# Altium project RFSOC_SAWG.PrjPCB (part 3 of 10)

## Sheet B2B_1.SchDoc: RFSOC_SAWG
size 420 x 297 mm; Author: G.Kasprowicz; CompanyName: WUT ISE; DrawnBy: G.Kasprowicz; Organization: WUT ISE; Address1: PW ISE; Address2: Nowowiejska 15/19 00-665 Warsaw; Address3: gkasprow@gmail.com; DocumentNumber: 10; Revision: 1; SheetNumber: 10; SheetTotal: 20; ModifiedBy: -; CheckedDate: -; Title2: B2B 1; DivGrp: WUT ISE; Designer: G.Kasprowicz; ModifiedDate: -; ProjectName: Sensor Box
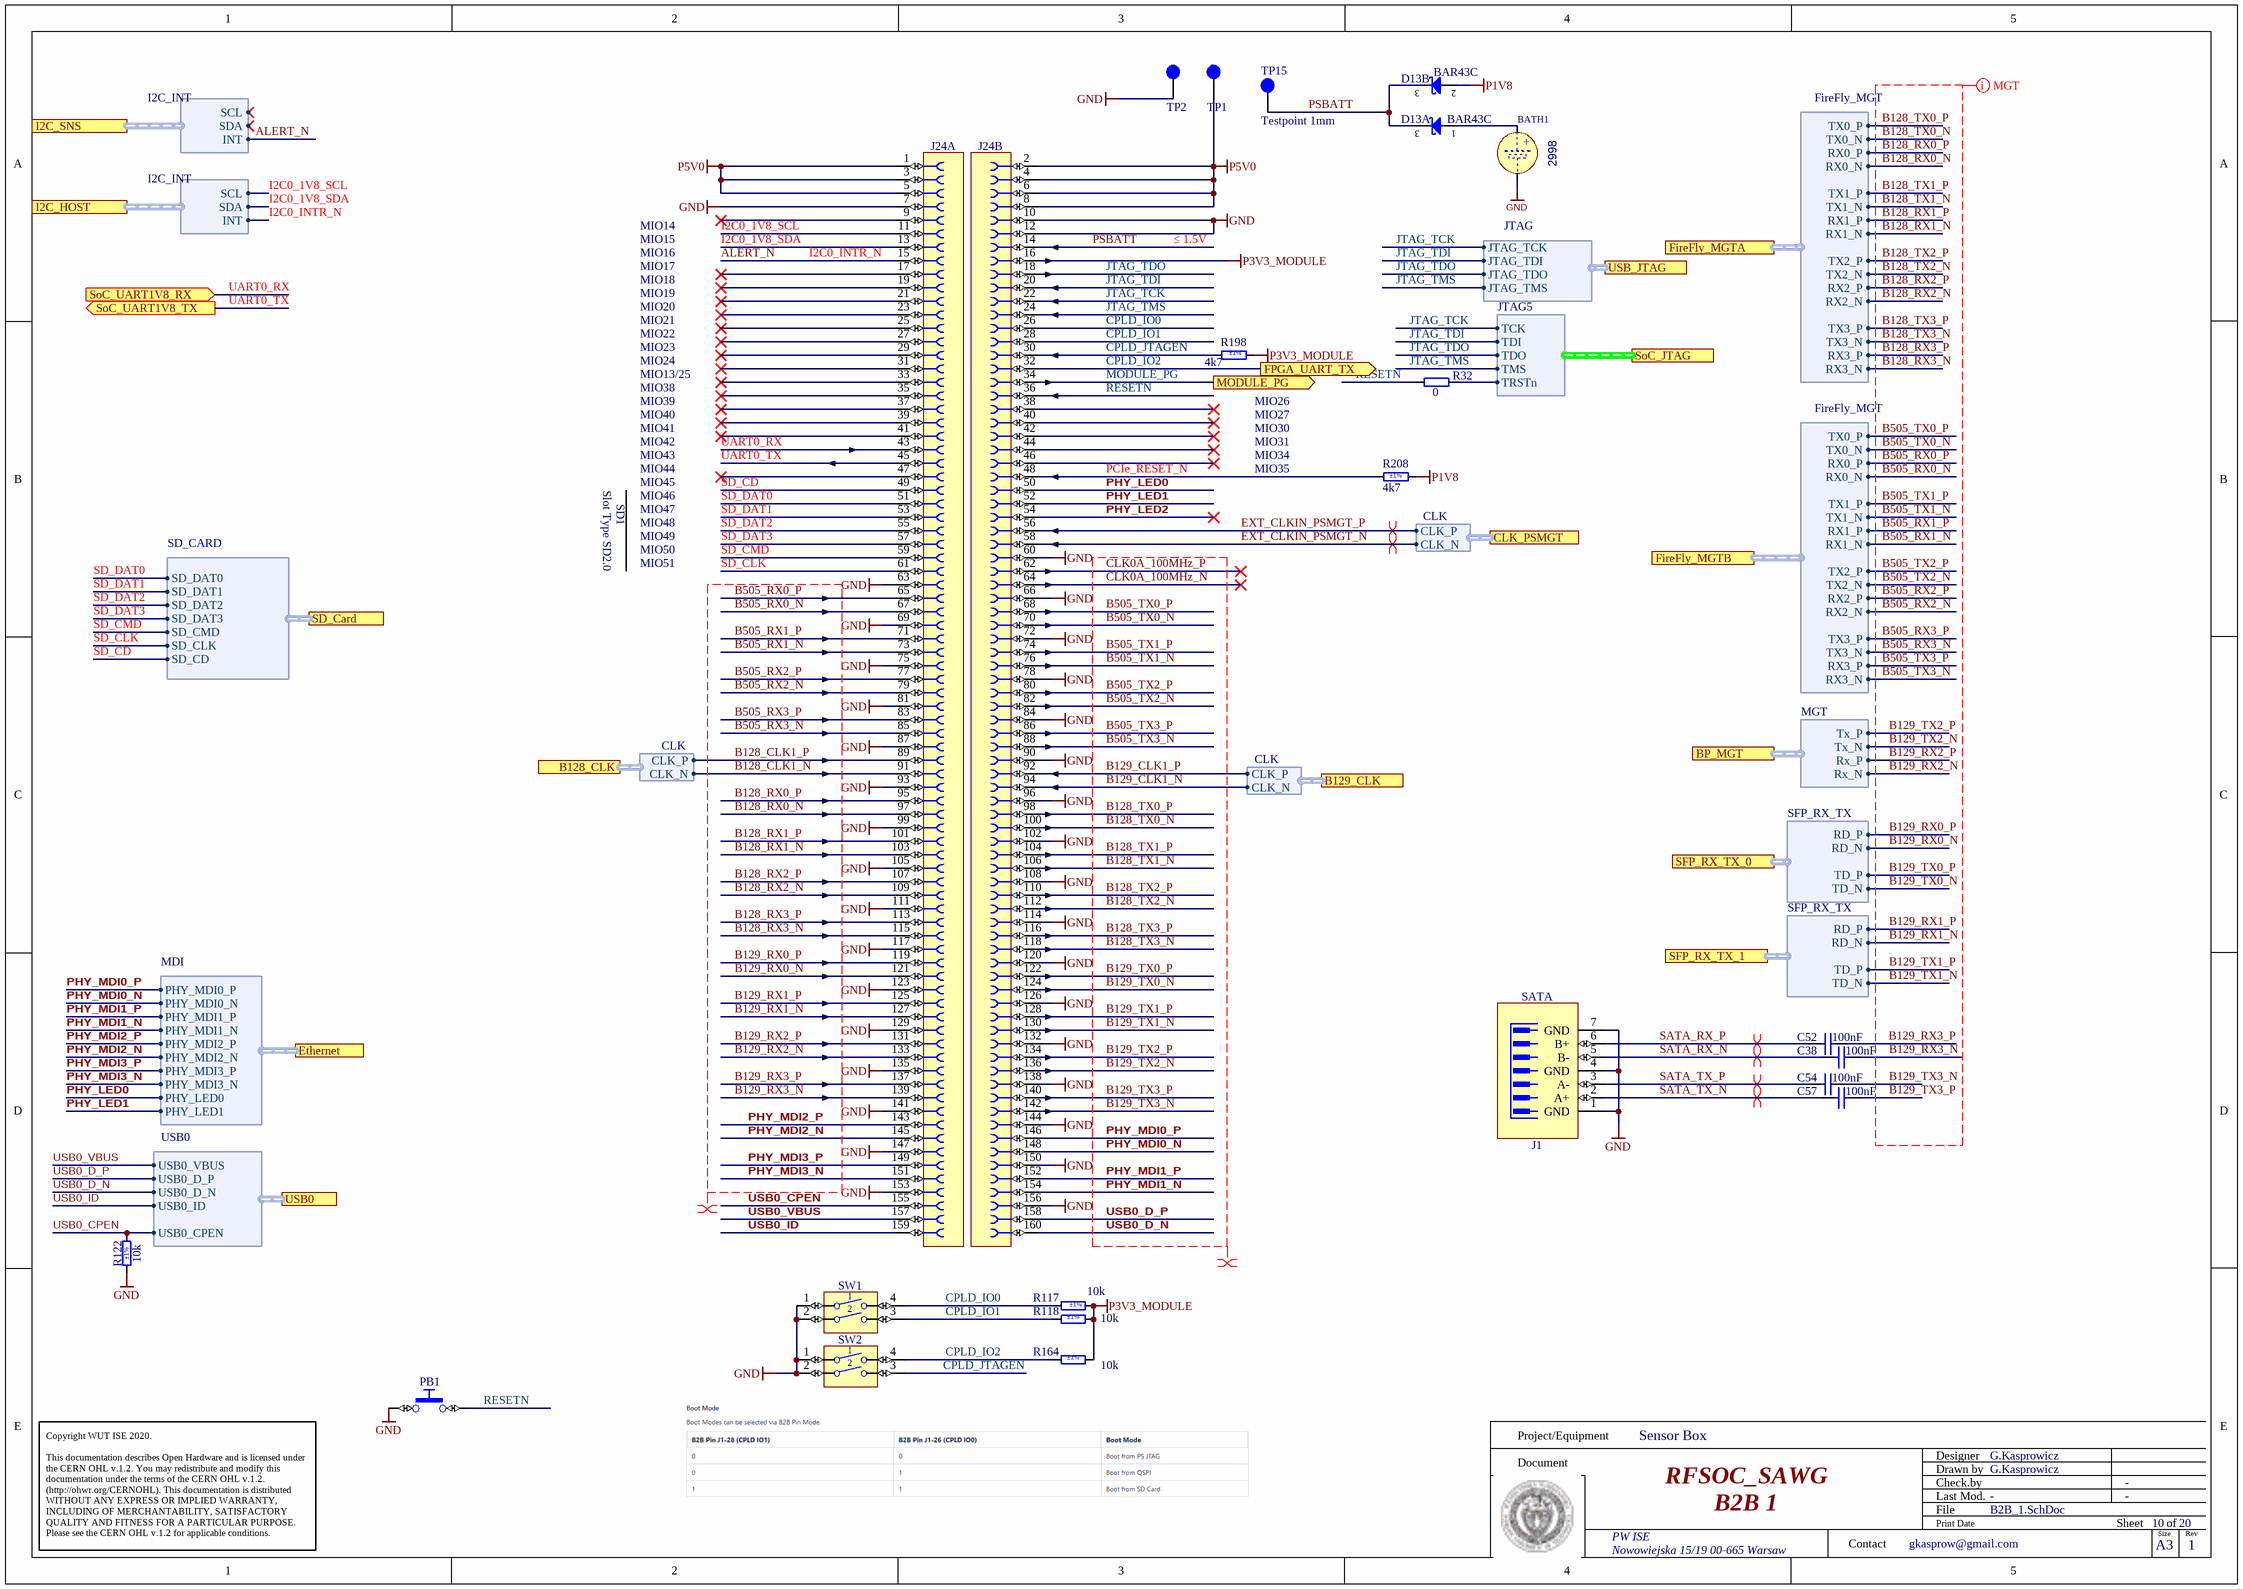
[diagram p5: B2B_1.SchDoc]

### Parts
BATH1  Manufacturer Part Number: 2998  [BATH_KEYSTONE_2998]
C38  100nF  [CAPC0603X33N]
C52  100nF  [CAPC0603X33N]
C54  100nF  [CAPC0603X33N]
C57  100nF  [CAPC0603X33N]
D13  BAR43C  [SOT95P240X130-3N]  (parts A,B of 2)
J1  SATA  [MOLEX_67800-5005]
J24  Socket 160  [SAMTEC_SS5-80-3.00-L-D-K]  (value not drawn)  (parts A,B of 2)
PB1  Push Button  [PB_TYCO_FSMSM]  (value not drawn)
R32  0  [RESC1005X40N]
R117  10k  Tolerance: ±1%  [RESC1005X40N]
R118  10k  Tolerance: ±1%  [RESC1005X40N]
R122  10k  Tolerance: ±1%  [RESC1005X40N]
R164  10k  Tolerance: ±1%  [RESC1005X40N]
R198  4k7  Tolerance: ±1%  [RESC1005X40N]
R208  4k7  Tolerance: ±1%  [RESC1005X40N]
SW1  Switch  [SW_OMRON_A6H-2102]  (value not drawn)
SW2  Switch  [SW_OMRON_A6H-2102]  (value not drawn)
TP1  Testpoint 0.8mm  [TP_0.8mm]  (value not drawn)  (no BOM)
TP2  Testpoint 0.8mm  [TP_0.8mm]  (value not drawn)  (no BOM)
TP15  Testpoint 1mm  [TP_1mm]  (no BOM)

### Ports
B128_CLK (harness CLK), B129_CLK (harness CLK), BP_MGT (harness MGT), CLK_PSMGT (harness CLK), Ethernet (harness MDI), FireFly_MGTA (harness FireFly_MGT), FireFly_MGTB (harness FireFly_MGT), FPGA_UART_TX (out), I2C_HOST (harness I2C_INT), I2C_SNS (harness I2C_INT), MODULE_PG (out), SD_Card (harness SD_CARD), SFP_RX_TX_0 (harness SFP_RX_TX), SFP_RX_TX_1 (harness SFP_RX_TX), SoC_JTAG (harness JTAG5), SoC_UART1V8_RX (in), SoC_UART1V8_TX (out), USB0 (harness USB0), USB_JTAG (harness JTAG)

### Harnesses
FireFly_MGT: RX1_P, RX1_N, RX2_P, RX2_N, RX3_P, RX3_N, RX0_P, RX0_N, TX1_P, TX1_N, TX2_P, TX2_N, TX3_P, TX3_N, TX0_P, TX0_N
SD_CARD: SD_DAT0, SD_DAT1, SD_DAT2, SD_DAT3, SD_CMD, SD_CLK, SD_CD
I2C_INT: SDA, SCL, INT
USB0: USB0_VBUS, USB0_D_P, USB0_D_N, USB0_ID, USB0_CPEN
MDI: PHY_MDI0_N, PHY_MDI1_P, PHY_MDI1_N, PHY_MDI2_P, PHY_MDI2_N, PHY_MDI3_P, PHY_MDI3_N, PHY_LED0, PHY_LED1, PHY_MDI0_P
CLK: CLK_P, CLK_N
JTAG5: TCK, TDI, TDO, TMS, TRSTn
MGT: Tx_P, Tx_N, Rx_P, Rx_N
SFP_RX_TX: RD_P, RD_N, TD_P, TD_N
JTAG: JTAG_TCK, JTAG_TDI, JTAG_TDO, JTAG_TMS

### Nets
GND: BATH1.2(MINUS) J1.1(GND) J1.4(GND) J1.7(GND) J24.7 J24.10 J24.12 J24.60 J24.63 J24.66 J24.69 J24.72 J24.75 J24.78 J24.81 J24.84 J24.87 J24.90 J24.93 J24.96 J24.99 J24.102 J24.105 J24.108 J24.111 J24.114 J24.117 J24.120 J24.123 J24.126 J24.129 J24.132 J24.135 J24.138 J24.141 J24.144 J24.147 J24.150 J24.153 J24.156 PB1.1 R122.1 SW1.1 SW1.2 SW2.1 SW2.2 TP2.1
P1V8: D13.2(A) R208.1
P3V3_MODULE: J24.16 R117.2 R118.2 R164.2 R198.1
P5V0: J24.1 J24.2 J24.3 J24.4 J24.5 J24.6 J24.8 TP1.1
ALERT_N: J24.15 ; port I2C_HOST.INT, port I2C_SNS.INT  [also labelled I2C0_INTR_N]
B128_CLK1_N: J24.91 ; port B128_CLK.CLK_N
B128_CLK1_P: J24.89 ; port B128_CLK.CLK_P
B128_RX0_N: J24.97 ; port FireFly_MGTA.RX0_N
B128_RX0_P: J24.95 ; port FireFly_MGTA.RX0_P
B128_RX1_N: J24.103 ; port FireFly_MGTA.RX1_N
B128_RX1_P: J24.101 ; port FireFly_MGTA.RX1_P
B128_RX2_N: J24.109 ; port FireFly_MGTA.RX2_N
B128_RX2_P: J24.107 ; port FireFly_MGTA.RX2_P
B128_RX3_N: J24.115 ; port FireFly_MGTA.RX3_N
B128_RX3_P: J24.113 ; port FireFly_MGTA.RX3_P
B128_TX0_N: J24.100 ; port FireFly_MGTA.TX0_N
B128_TX0_P: J24.98 ; port FireFly_MGTA.TX0_P
B128_TX1_N: J24.106 ; port FireFly_MGTA.TX1_N
B128_TX1_P: J24.104 ; port FireFly_MGTA.TX1_P
B128_TX2_N: J24.112 ; port FireFly_MGTA.TX2_N
B128_TX2_P: J24.110 ; port FireFly_MGTA.TX2_P
B128_TX3_N: J24.118 ; port FireFly_MGTA.TX3_N
B128_TX3_P: J24.116 ; port FireFly_MGTA.TX3_P
B129_CLK1_N: J24.94 ; port B129_CLK.CLK_N
B129_CLK1_P: J24.92 ; port B129_CLK.CLK_P
B129_RX0_N: J24.121 ; port SFP_RX_TX_0.RD_N
B129_RX0_P: J24.119 ; port SFP_RX_TX_0.RD_P
B129_RX1_N: J24.127 ; port SFP_RX_TX_1.RD_N
B129_RX1_P: J24.125 ; port SFP_RX_TX_1.RD_P
B129_RX2_N: J24.133 ; port BP_MGT.Rx_N
B129_RX2_P: J24.131 ; port BP_MGT.Rx_P
B129_RX3_N: C38.2 J24.139
B129_RX3_P: C52.2 J24.137
B129_TX0_N: J24.124 ; port SFP_RX_TX_0.TD_N
B129_TX0_P: J24.122 ; port SFP_RX_TX_0.TD_P
B129_TX1_N: J24.130 ; port SFP_RX_TX_1.TD_N
B129_TX1_P: J24.128 ; port SFP_RX_TX_1.TD_P
B129_TX2_N: J24.136 ; port BP_MGT.Tx_N
B129_TX2_P: J24.134 ; port BP_MGT.Tx_P
B129_TX3_N: C54.2 J24.142
B129_TX3_P: C57.2 J24.140
B505_RX0_N: J24.67 ; port FireFly_MGTB.RX0_N
B505_RX0_P: J24.65 ; port FireFly_MGTB.RX0_P
B505_RX1_N: J24.73 ; port FireFly_MGTB.RX1_N
B505_RX1_P: J24.71 ; port FireFly_MGTB.RX1_P
B505_RX2_N: J24.79 ; port FireFly_MGTB.RX2_N
B505_RX2_P: J24.77 ; port FireFly_MGTB.RX2_P
B505_RX3_N: J24.85 ; port FireFly_MGTB.TX3_N
B505_RX3_P: J24.83 ; port FireFly_MGTB.TX3_P
B505_TX0_N: J24.70 ; port FireFly_MGTB.TX0_N
B505_TX0_P: J24.68 ; port FireFly_MGTB.TX0_P
B505_TX1_N: J24.76 ; port FireFly_MGTB.TX1_N
B505_TX1_P: J24.74 ; port FireFly_MGTB.TX1_P
B505_TX2_N: J24.82 ; port FireFly_MGTB.TX2_N
B505_TX2_P: J24.80 ; port FireFly_MGTB.TX2_P
B505_TX3_N: J24.88 ; port FireFly_MGTB.RX3_N
B505_TX3_P: J24.86 ; port FireFly_MGTB.RX3_P
CLK0A_100MHz_N: J24.64
CLK0A_100MHz_P: J24.62
CPLD_IO0: J24.26 R117.1 SW1.4
CPLD_IO1: J24.28 R118.1 SW1.3
CPLD_IO2: J24.32 R164.1 SW2.4 ; port FPGA_UART_TX
CPLD_JTAGEN: J24.30 R198.2 SW2.3
EXT_CLKIN_PSMGT_N: J24.58 ; port CLK_PSMGT.CLK_N  [project net CK_GTP_N]
EXT_CLKIN_PSMGT_P: J24.56 ; port CLK_PSMGT.CLK_P  [project net CK_GTP_P]
I2C0_1V8_SCL: J24.11 ; port I2C_HOST.SCL
I2C0_1V8_SDA: J24.13 ; port I2C_HOST.SDA
JTAG_TCK: J24.22 ; port SoC_JTAG.TCK, port USB_JTAG.JTAG_TCK
JTAG_TDI: J24.20 ; port SoC_JTAG.TDI, port USB_JTAG.JTAG_TDI
JTAG_TDO: J24.18 ; port SoC_JTAG.TDO, port USB_JTAG.JTAG_TDO
JTAG_TMS: J24.24 ; port SoC_JTAG.TMS, port USB_JTAG.JTAG_TMS
JTAG_TRSTn: R32.2 ; port SoC_JTAG.TRSTn
MODULE_PG: J24.34 ; port MODULE_PG  [project net EN_clk_3V6]
PCIe_RESET_N: J24.48 R208.2
PHY_LED0: J24.50 ; port Ethernet.PHY_LED0
PHY_LED1: J24.52 ; port Ethernet.PHY_LED1
PHY_LED2: J24.54
PHY_MDI0_N: J24.148 ; port Ethernet.PHY_MDI0_N
PHY_MDI0_P: J24.146 ; port Ethernet.PHY_MDI0_P
PHY_MDI1_N: J24.154 ; port Ethernet.PHY_MDI1_N
PHY_MDI1_P: J24.152 ; port Ethernet.PHY_MDI1_P
PHY_MDI2_N: J24.145 ; port Ethernet.PHY_MDI2_N
PHY_MDI2_P: J24.143 ; port Ethernet.PHY_MDI2_P
PHY_MDI3_N: J24.151 ; port Ethernet.PHY_MDI3_N
PHY_MDI3_P: J24.149 ; port Ethernet.PHY_MDI3_P
PSBATT: D13.3(COMC) J24.14 TP15.1
RESETN: J24.36 PB1.2 R32.1
SATA_RX_N: C38.1 J1.5(B-)
SATA_RX_P: C52.1 J1.6(B+)
SATA_TX_N: C57.1 J1.2(A+)
SATA_TX_P: C54.1 J1.3(A-)
SD_CD: J24.49 ; port SD_Card.SD_CD
SD_CLK: J24.61 ; port SD_Card.SD_CLK
SD_CMD: J24.59 ; port SD_Card.SD_CMD
SD_DAT0: J24.51 ; port SD_Card.SD_DAT0
SD_DAT1: J24.53 ; port SD_Card.SD_DAT1
SD_DAT2: J24.55 ; port SD_Card.SD_DAT2
SD_DAT3: J24.57 ; port SD_Card.SD_DAT3
UART0_RX: J24.43 ; port SoC_UART1V8_RX
UART0_TX: J24.45 ; port SoC_UART1V8_TX
USB0_CPEN: J24.155 R122.2 ; port USB0.USB0_CPEN
USB0_D_N: J24.160 ; port USB0.USB0_D_N
USB0_D_P: J24.158 ; port USB0.USB0_D_P
USB0_ID: J24.159 ; port USB0.USB0_ID
USB0_VBUS: J24.157 ; port USB0.USB0_VBUS
NetBATH1_1: BATH1.1(PLUS) D13.1(A)

Not connected (* = marked no-connect by the designer): J24 9* 17* 19* 21* 23* 25* 27* 29* 31* 33* 35* 37* 38* 39* 40* 41* 42* 44* 46* 47*

### Layout directives
differential pair: B128_CLK1_N, B128_CLK1_P, B128_RX0_N, B128_RX0_P, B128_RX1_N, B128_RX1_P, B128_RX2_N, B128_RX2_P, B128_RX3_N, B128_RX3_P, B128_TX0_N, B128_TX0_P, B128_TX1_N, B128_TX1_P, B128_TX2_N, B128_TX2_P, B128_TX3_N, B128_TX3_P, B129_CLK1_N, B129_CLK1_P, B129_RX0_N, B129_RX0_P, B129_RX1_N, B129_RX1_P, B129_RX2_N, B129_RX2_P, B129_RX3_N, B129_RX3_P, B129_TX0_N, B129_TX0_P, B129_TX1_N, B129_TX1_P, B129_TX2_N, B129_TX2_P, B129_TX3_N, B129_TX3_P, B505_RX0_N, B505_RX0_P, B505_RX1_N, B505_RX1_P, B505_RX2_N, B505_RX2_P, B505_RX3_N, B505_RX3_P, B505_TX0_N, B505_TX0_P, B505_TX1_N, B505_TX1_P, B505_TX2_N, B505_TX2_P, B505_TX3_N, B505_TX3_P, CK_GTP_N, CK_GTP_P, CLK0A_100MHz_N, CLK0A_100MHz_P, PHY_MDI0_N, PHY_MDI0_P, PHY_MDI1_N, PHY_MDI1_P, PHY_MDI2_N, PHY_MDI2_P, PHY_MDI3_N, PHY_MDI3_P, USB0_D_N, USB0_D_P
differential pair; net class Diff_100Ohm: SATA_RX_N, SATA_RX_P, SATA_TX_N, SATA_TX_P
net class MGT: B128_RX0_N, B128_RX0_P, B128_RX1_N, B128_RX1_P, B128_RX2_N, B128_RX2_P, B128_RX3_N, B128_RX3_P, B128_TX0_N, B128_TX0_P, B128_TX1_N, B128_TX1_P, B128_TX2_N, B128_TX2_P, B128_TX3_N, B128_TX3_P, B129_RX0_N, B129_RX0_P, B129_RX1_N, B129_RX1_P, B129_RX2_N, B129_RX2_P, B129_RX3_N, B129_RX3_P, B129_TX0_N, B129_TX0_P, B129_TX1_N, B129_TX1_P, B129_TX2_N, B129_TX2_P, B129_TX3_N, B129_TX3_P, B505_RX0_N, B505_RX0_P, B505_RX1_N, B505_RX1_P, B505_RX2_N, B505_RX2_P, B505_RX3_N, B505_RX3_P, B505_TX0_N, B505_TX0_P, B505_TX1_N, B505_TX1_P, B505_TX2_N, B505_TX2_P, B505_TX3_N, B505_TX3_P

### Notes on the sheet
- MIO14
- MIO15
- MIO16
- ≤ 1.5V
- MIO17
- MIO18
- MIO19
- MIO20
- MIO21
- MIO22
- MIO23
- MIO24
- MIO13/25
- MIO38
- MIO39
- MIO40
- MIO41
- MIO42
- MIO43
- (near R198) MIO26
- MIO27
- MIO30
- MIO31
- MIO34
- Slot Type SD2.0
- SD1
- MIO45
- MIO46
- MIO47
- MIO48
- MIO44
- MIO35
- MIO49
- MIO50
- MIO51
- Project/Equipment
- Document
- Designer
- Drawn by
- Check.by
- Copyright WUT ISE 2020.
  This documentation describes Open Hardware and is licensed under the CERN OHL v.1.2. You may redistribute and modify this documentation under the terms of the CERN OHL v.1.2. (http://ohwr.org/CERNOHL). This documentation is distributed WITHOUT ANY EXPRESS OR IMPLIED WARRANTY, INCLUDING OF MERCHANTABILITY, SATISFACTORY QUALITY AND FITNESS FOR A PARTICULAR PURPOSE. Please see the CERN OHL v.1.2 for applicable conditions.
- Contact
- File
- Last Mod.
- Print Date
- Sheet
- Size
- A3
- of
- Rev
- (in symbol BATH_KEYSTONE_2998) +

### Library data of the parts
BATH1 = BATH_KEYSTONE_2998: Battery Holder whit 2 Pin; Part Description: SMD Battery Holder for MC621, V364, SC621, DR13H, DR77, V13AT, 377 Button Cells; PressFit: No; Manufacturer: KEYSTONE; PackageDescription: SMD Battery Holder for MC621, V364, SC621, DR13H, DR77, V13AT, 377 Button Cells; Part Number: BATH_KEYSTONE_2998; Component Kind: Standard; Component Type: Standard; Pin Count: 3; Family: Battery; Mounted: Yes; Socket: No; SMD: Yes; Sense: No; ComponentHeight: 3.048mm; HelpURL: \\cern.ch\dfs\Applications\Altium\Datasheets\BATH_KEYSTONE_2998.pdf; Author: CERN DEM JLC; CreateDate: 03.07.2014; LatestRevisionDate: 07.06.2017
C38 C52 C54 C57 = CC0201_100NF_6.3V_10%_X5R: Non-polarised capacitor; Part Description: SMD Multilayer Chip Ceramic Capacitor; Manufacturer: GENERIC; Manufacturer1 Part Number: 02016D104KAT2A; Voltage: 6.3V; TC: X5R; Tolerance: ±10%; Part Number: CC0201_100NF_6.3V_10%_X5R; Component Kind: Standard; Component Type: Standard; Pin Count: 2; Value: 100nF; Status: Not Recommended; Manufacturer Part Number: CC0201_100NF_6.3V_10%_X5R; Case: 0201; Mounted: Yes; Socket: No; SMD: Yes; Sense: No; Manufacturer1 Example: AVX; Manufacturer1 ComponentHeight: 0.33mm; HelpURL: \\cern.ch\dfs\Applications\Altium\Datasheets\CC0201_X5R_AVX.pdf; Author: CERN DEM JLC; CreateDate: 2007-12-03; LatestRevisionDate: 2007-12-03; ClassName: SATA
D13 = BAR43C: Dual Common Cathode Schottky Diodes; Manufacturer: FAIRCHILD SEMICONDUCTOR; Voltage: 30V; Power: 200mA; PressFit: No; Bonding: No; Part Number: BAR43C; Component Kind: Standard; Component Type: Standard; Device: BAR43C; PackageDescription: SOT, 0.95mm Pitch; 3 Pin, 1.30mm W X 2.90mm L X 1.30mm H body, IPC Medium Density; Part Description: Dual Common Cathode Schottky Diode; Manufacturer Part Number: BAR43C; Pin Count: 3; Case: SOT23-3; Mounted: Yes; Socket: No; SMD: Yes; Sense: No; ComponentHeight: 1.30mm; HelpURL: \\cern.ch\dfs\Applications\Altium\Datasheets\BAR43C.pdf; Author: CERN DEM JLC; CreateDate: 27.05.2010; LatestRevisionDate: 27.05.2010
J1 = MOLEX_67800-5005: 7 Pin SATA Receptacle; Part Description: 1.27mm Pitch, 7 Contacts, Serial ATA High Speed Header, Straight with Locking Latch; Manufacturer: MOLEX; PressFit: No; Part Number: MOLEX_67800-5005; Component Kind: Standard; Component Type: Standard; Pin Count: 7; Family: SATA; Mounted: Yes; Socket: No; SMD: Yes; Sense: No; Status: None; Manufacturer Part Number: 67800-5005; ComponentHeight: 8.4mm; HelpURL: \\cern.ch\dfs\Applications\Altium\Datasheets\MOLEX_67800-5005.pdf; Author: CERN DEM MR; CreateDate: 01.12.2016; LatestRevisionDate: 01.12.2016; ClassName: SATA
J24 = SAMTEC_SS5-80-3.00-L-D-K: Connector 160 Female; Part Description: 160 Contacts, Pitch 0.50 mm Micro Blade & Beam Low-Profile Socket; Manufacturer: SAMTEC; PressFit: No; Part Number: SAMTEC_SS5-80-3.00-L-D-K; Component Kind: Standard; Component Type: Standard; Pin Count: 160; Family: Socket 160; Mounted: Yes; Socket: No; SMD: Yes; Sense: No; Status: None; Manufacturer Part Number: SS5-80-3.00-L-D-K; ComponentHeight: 4mm; HelpURL: \\cern.ch\dfs\Applications\Altium\Datasheets\SAMTEC_SS5-80-3.00-L-D-K.pdf; Author: CERN DEM BC; CreateDate: 11.08.2021; LatestRevisionDate: 11.08.2021
PB1 = PB_TYCO_FSMSM: Push-Button Switch SPDT; Part Description: 12VDC 50mA SPST Tactile  Push-Button Switch; Manufacturer: TYCO ELECTRONICS; Manufacturer Part Number: FSMSM or 1437566-3; PressFit: No; Part Number: PB_TYCO_FSMSM; Component Kind: Standard; Component Type: Standard; Pin Count: 2; PackageDescription: Body 3.5x6.0mm, Pushbutton Switch,  TYCO ALCOSWITCH FSMSM Serie; Family: Push Button; Mounted: Yes; Socket: No; SMD: Yes; Sense: No; Status: None; ComponentHeight: 4.3mm; HelpURL: \\cern.ch\dfs\Applications\Altium\Datasheets\PB_TYCO_FSMSM.pdf; Author: CERN DEM JLC; CreateDate: 30.06.2008; LatestRevisionDate: 21.06.2012
R32 = R0402_0R_JUMPER: Resistor; Part Description: 1A (0.05R Max DC Resistance) Zero Ohm Jumper; Manufacturer: GENERIC; Manufacturer1 Part Number: 232270591001L; PressFit: No; Part Number: R0402_0R_JUMPER; Component Kind: Standard; Component Type: Standard; Pin Count: 2; Value: 0; Status: Not Recommended; Manufacturer Part Number: R0402_0R_JUMPER; Case: 0402; Mounted: Yes; Sense: No; Socket: No; SMD: Yes; Manufacturer1 Example: YAGEO PHYCOMP; Manufacturer1 ComponentHeight: 0.4mm; HelpURL: \\cern.ch\dfs\Applications\Altium\Datasheets\R0402_Phycomp_RC0402.pdf; Author: CERN DEM JLC; CreateDate: 03.12.2007; LatestRevisionDate: 17.10.2012
R117 R118 R122 R164 = R0402_10K_1%_0.0625W_100PPM: Resistor - 1%; Part Description: General Purpose Thick Film Chip Resistor; Manufacturer: GENERIC; Manufacturer1 Part Number: 232270671003L; TC: ±100ppm/°C; PressFit: No; Case: 0402; Value: 10k; Part Number: R0402_10K_1%_0.0625W_100PPM; Component Kind: Standard; Component Type: Standard; Pin Count: 2; Status: Not Recommended; Power: 0.0625W; Manufacturer Part Number: R0402_10K_1%_0.0625W_100PPM; Mounted: Yes; Sense: No; Socket: No; SMD: Yes; Manufacturer1 Example: YAGEO PHYCOMP; Manufacturer1 ComponentHeight: 0.4mm; HelpURL: \\cern.ch\dfs\Applications\Altium\Datasheets\R0402_Phycomp_RC0402.pdf; Author: CERN DEM JLC; CreateDate: 03.12.2007; LatestRevisionDate: 17.10.2012
R198 R208 = R0402_4K7_1%_0.0625W_100PPM: Resistor - 1%; Part Description: General Purpose Thick Film Chip Resistor; Manufacturer: GENERIC; Manufacturer1 Part Number: 232270674702L; TC: ±100ppm/°C; PressFit: No; Case: 0402; Value: 4k7; Part Number: R0402_4K7_1%_0.0625W_100PPM; Component Kind: Standard; Component Type: Standard; Pin Count: 2; Status: Not Recommended; Power: 0.0625W; Manufacturer Part Number: R0402_4K7_1%_0.0625W_100PPM; Mounted: Yes; Sense: No; Socket: No; SMD: Yes; Manufacturer1 Example: YAGEO PHYCOMP; Manufacturer1 ComponentHeight: 0.4mm; HelpURL: \\cern.ch\dfs\Applications\Altium\Datasheets\R0402_Phycomp_RC0402.pdf; Author: CERN DEM JLC; CreateDate: 03.12.2007; LatestRevisionDate: 17.10.2012
SW1 SW2 = SW_OMRON_A6H-2102: 2 Ways SPST DIP Switch; Part Description: 2 Ways Ultra-low Profile, Half-pitch, SPST DIP Switch With Seal Tape, Rating 25mA 24VDC; Manufacturer: OMRON; PressFit: No; Part Number: SW_OMRON_A6H-2102; Component Kind: Standard; Component Type: Standard; Pin Count: 4; PackageDescription: Pitch 1.27mm, Body 3.77 x 4.5mm, 2 Ways SPST Surface-Mounting DIP Switch, OMRON A6H; Family: Switch; Mounted: Yes; Socket: No; SMD: Yes; Sense: No; Status: None; Manufacturer Part Number: A6H-2102; ComponentHeight: 1.45mm; HelpURL: \\cern.ch\dfs\Applications\Altium\Datasheets\SW_OMRON_A6H-2102.pdf; Author: CERN DEM BC; CreateDate: 18.08.2021; LatestRevisionDate: 18.08.2021
TP1 TP2 = 26289: AN: 26289; Mixed: MECH
TP15 = 25063: AN: 25063; Mixed: SMT

## Sheet B2B_2.SchDoc: RFSOC_SAWG
size 420 x 297 mm; Author: G.Kasprowicz; CompanyName: WUT ISE; DrawnBy: G.Kasprowicz; Organization: WUT ISE; Address1: PW ISE; Address2: Nowowiejska 15/19 00-665 Warsaw; Address3: gkasprow@gmail.com; DocumentNumber: 11; Revision: 1; SheetNumber: 11; SheetTotal: 20; ModifiedBy: -; CheckedDate: -; Title2: B2B 2; DivGrp: WUT ISE; Designer: G.Kasprowicz; ModifiedDate: -; ProjectName: Sensor Box
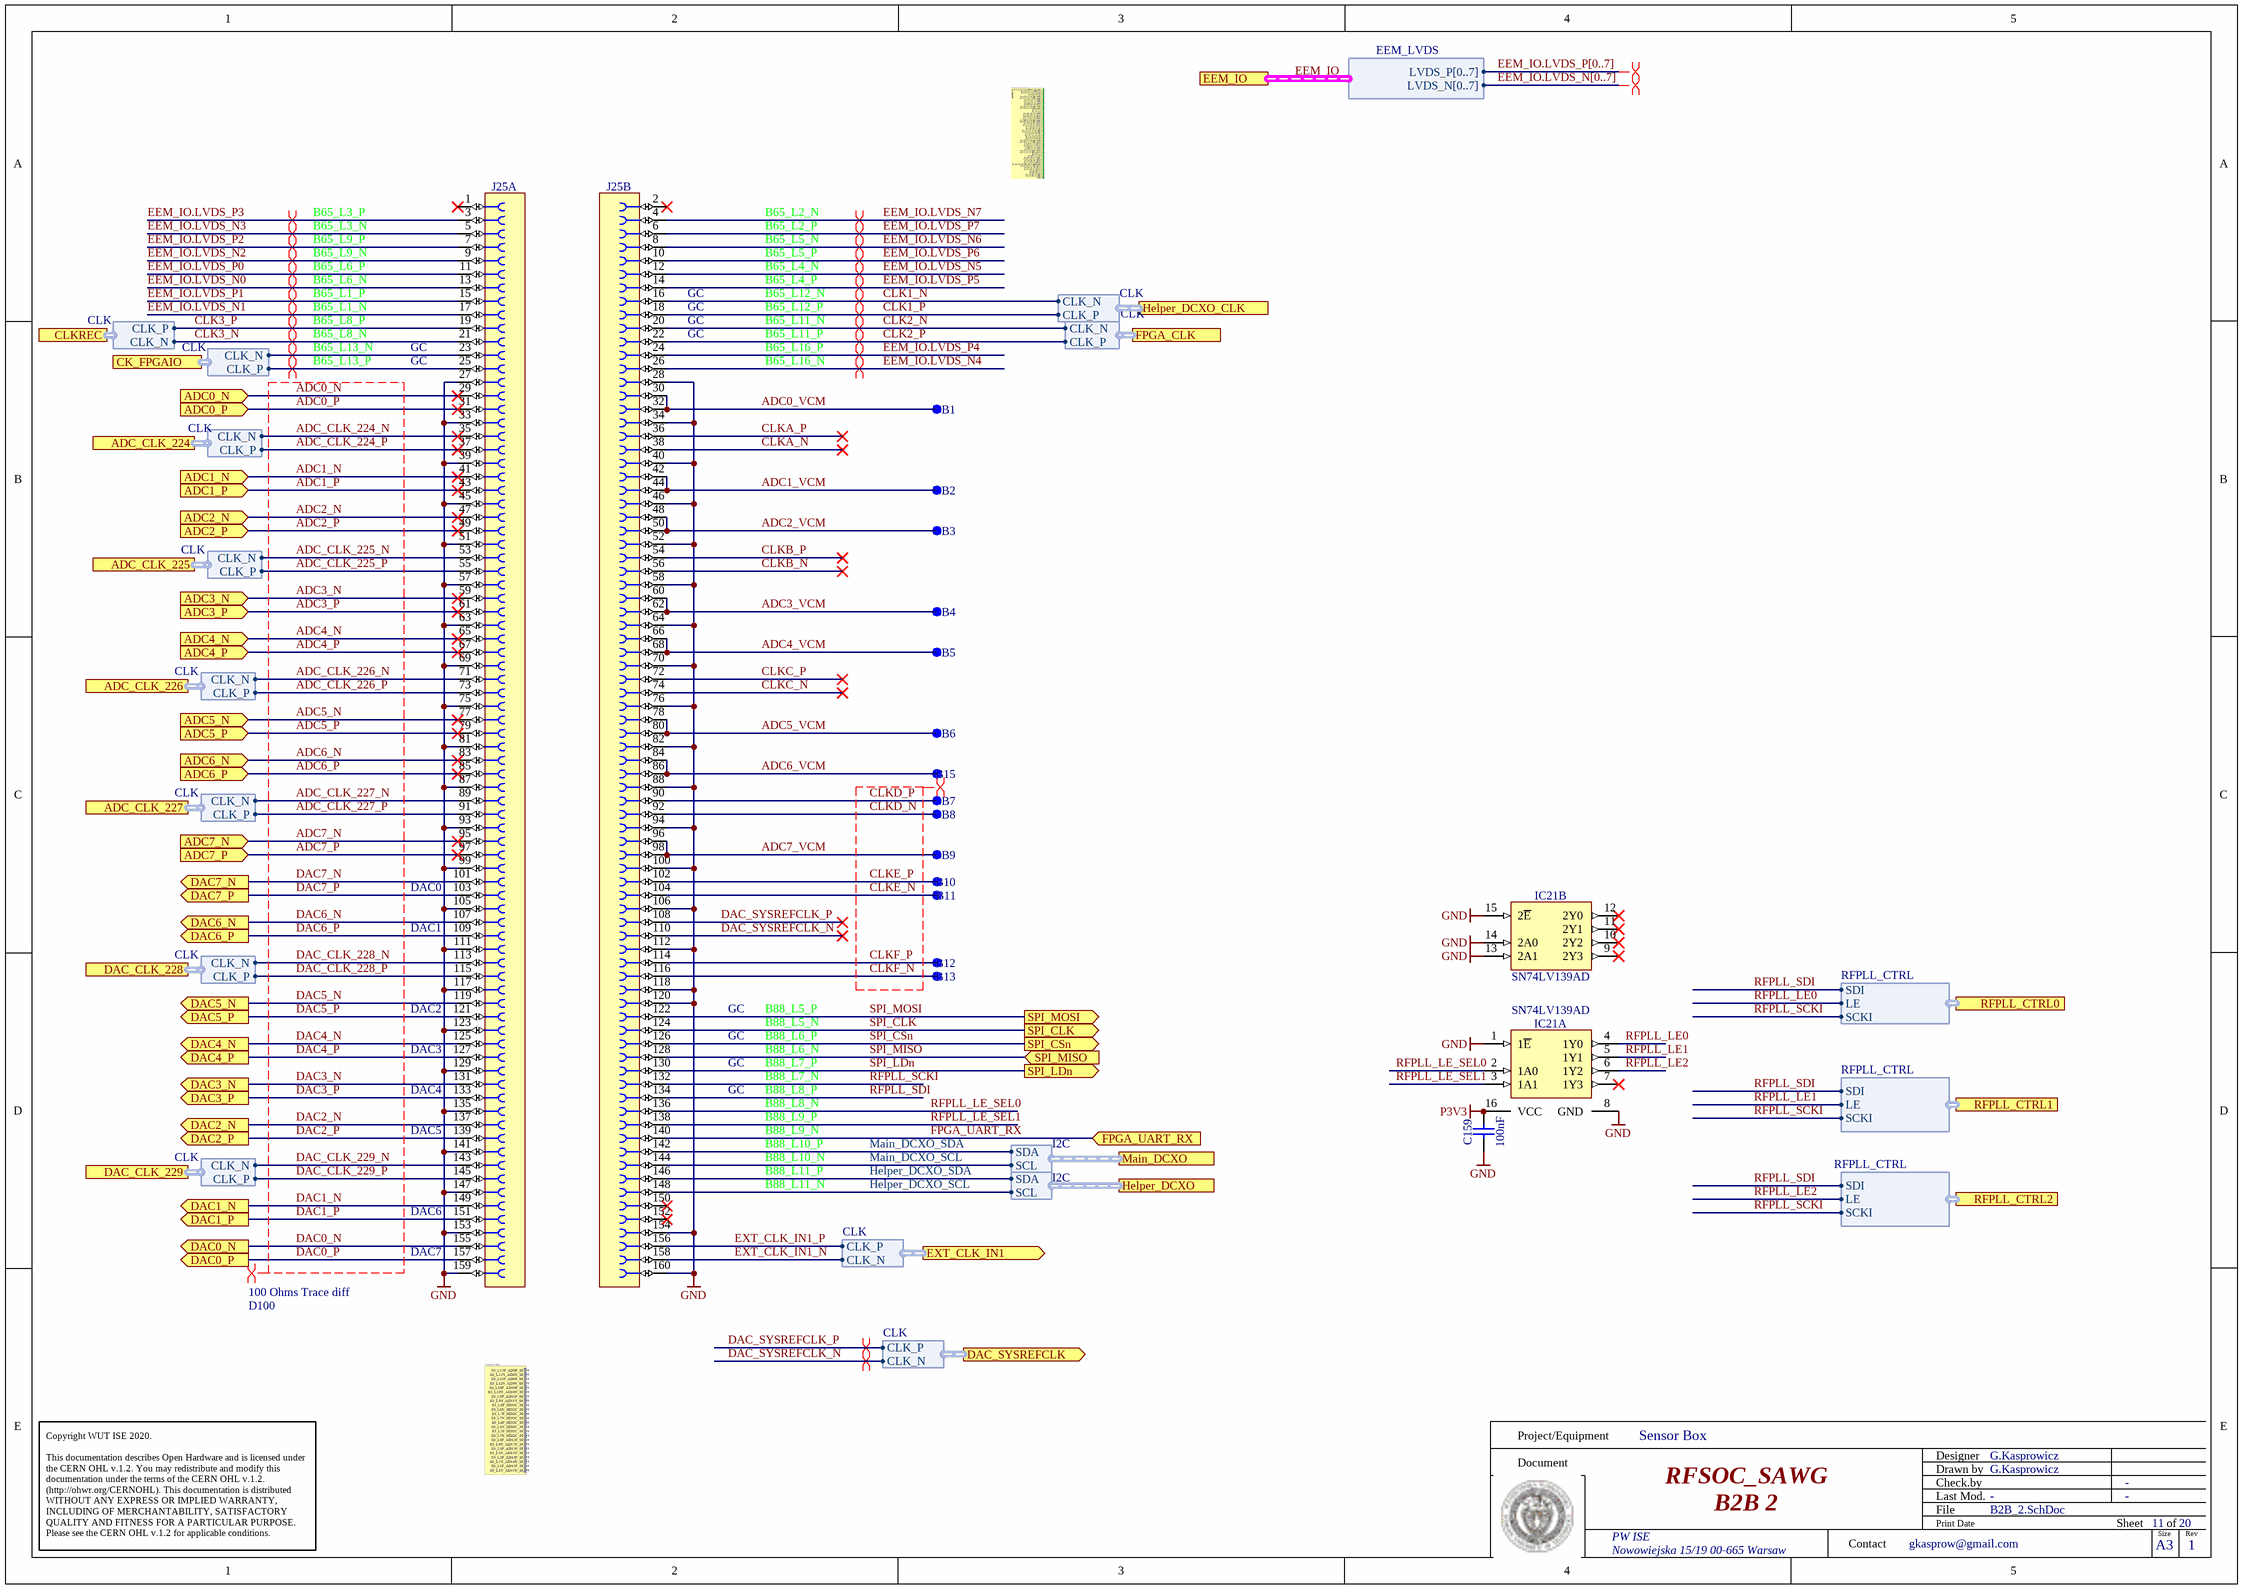
[diagram p6: B2B_2.SchDoc]

### Parts
B1  SMD Pad  [C100]  (value not drawn)  (no BOM)
B2  SMD Pad  [C100]  (value not drawn)  (no BOM)
B3  SMD Pad  [C100]  (value not drawn)  (no BOM)
B4  SMD Pad  [C100]  (value not drawn)  (no BOM)
B5  SMD Pad  [C100]  (value not drawn)  (no BOM)
B6  SMD Pad  [C100]  (value not drawn)  (no BOM)
B7  SMD Pad  [C100]  (value not drawn)  (no BOM)
B8  SMD Pad  [C100]  (value not drawn)  (no BOM)
B9  SMD Pad  [C100]  (value not drawn)  (no BOM)
B10  SMD Pad  [C100]  (value not drawn)  (no BOM)
B11  SMD Pad  [C100]  (value not drawn)  (no BOM)
B12  SMD Pad  [C100]  (value not drawn)  (no BOM)
B13  SMD Pad  [C100]  (value not drawn)  (no BOM)
B15  SMD Pad  [C100]  (value not drawn)  (no BOM)
C159  100nF  [CAPC1005X55N]
IC21  SN74LV139AD  [SOIC127P600X175-16N]  (parts A,B of 2)
J25  Socket 160  [SAMTEC_SS5-80-3.00-L-D-K]  (value not drawn)  (parts A,B of 2)

### Ports
ADC0_N (in), ADC0_P (in), ADC1_N (in), ADC1_P (in), ADC2_N (in), ADC2_P (in), ADC3_N (in), ADC3_P (in), ADC4_N (in), ADC4_P (in), ADC5_N (in), ADC5_P (in), ADC6_N (in), ADC6_P (in), ADC7_N (in), ADC7_P (in), ADC_CLK_224 (harness CLK), ADC_CLK_225 (harness CLK), ADC_CLK_226 (harness CLK), ADC_CLK_227 (harness CLK), CK_FPGAIO (harness CLK), CLKREC (harness CLK), DAC0_N (out), DAC0_P (out), DAC1_N (out), DAC1_P (out), DAC2_N (out), DAC2_P (out), DAC3_N (out), DAC3_P (out), DAC4_N (out), DAC4_P (out), DAC5_N (out), DAC5_P (out), DAC6_N (out), DAC6_P (out), DAC7_N (out), DAC7_P (out), DAC_CLK_228 (harness CLK), DAC_CLK_229 (harness CLK), DAC_SYSREFCLK (out, harness CLK), EEM_IO (harness EEM_LVDS), EXT_CLK_IN1 (out, harness CLK), FPGA_CLK (harness CLK), FPGA_UART_RX (in), Helper_DCXO (harness I2C), Helper_DCXO_CLK (harness CLK), Main_DCXO (harness I2C), RFPLL_CTRL0 (harness RFPLL_CTRL), RFPLL_CTRL1 (harness RFPLL_CTRL), RFPLL_CTRL2 (harness RFPLL_CTRL), SPI_CLK (out), SPI_CSn (out), SPI_LDn (out), SPI_MISO (in), SPI_MOSI (out)

### Harnesses
CLK: CLK_P, CLK_N
CLK: CLK_N, CLK_P
EEM_LVDS: LVDS_P[0..7], LVDS_N[0..7]
RFPLL_CTRL: SCKI, SDI, LE
I2C: SCL, SDA

### Nets
GND: C159.1 IC21.1(1~{E}) IC21.8(GND) IC21.13(2A1) IC21.14(2A0) IC21.15(2~{E}) J25.27 J25.28 J25.33 J25.34 J25.39 J25.40 J25.45 J25.46 J25.51 J25.52 J25.57 J25.58 J25.63 J25.64 J25.69 J25.70 J25.75 J25.76 J25.81 J25.82 J25.87 J25.88 J25.93 J25.94 J25.99 J25.100 J25.105 J25.106 J25.111 J25.112 J25.117 J25.118 J25.120 J25.123 J25.129 J25.135 J25.141 J25.147 J25.153 J25.154 J25.159 J25.160
P3V3: C159.2 IC21.16(VCC)
ADC0_N: J25.29 ; port ADC0_N
ADC0_P: J25.31 ; port ADC0_P
ADC0_VCM: B1.1 J25.30 J25.32
ADC1_N: J25.41 ; port ADC1_N  [project net ADC0_N]
ADC1_P: J25.43 ; port ADC1_P  [project net ADC0_P]
ADC1_VCM: B2.1 J25.42 J25.44
ADC2_N: J25.47 ; port ADC2_N  [project net ADC0_N]
ADC2_P: J25.49 ; port ADC2_P  [project net ADC0_P]
ADC2_VCM: B3.1 J25.48 J25.50
ADC3_N: J25.59 ; port ADC3_N  [project net ADC0_N]
ADC3_P: J25.61 ; port ADC3_P  [project net ADC0_P]
ADC3_VCM: B4.1 J25.60 J25.62
ADC4_N: J25.65 ; port ADC4_N  [project net ADC0_N]
ADC4_P: J25.67 ; port ADC4_P  [project net ADC0_P]
ADC4_VCM: B5.1 J25.66 J25.68
ADC5_N: J25.77 ; port ADC5_N  [project net ADC0_N]
ADC5_P: J25.79 ; port ADC5_P  [project net ADC0_P]
ADC5_VCM: B6.1 J25.78 J25.80
ADC6_N: J25.83 ; port ADC6_N  [project net ADC0_N]
ADC6_P: J25.85 ; port ADC6_P  [project net ADC0_P]
ADC6_VCM: B15.1 J25.84 J25.86
ADC7_N: J25.95 ; port ADC7_N  [project net ADC0_N]
ADC7_P: J25.97 ; port ADC7_P  [project net ADC0_P]
ADC7_VCM: B9.1 J25.96 J25.98
ADC_CLK_224_N: J25.35 ; port ADC_CLK_224.CLK_N
ADC_CLK_224_P: J25.37 ; port ADC_CLK_224.CLK_P
ADC_CLK_225_N: J25.53 ; port ADC_CLK_225.CLK_N
ADC_CLK_225_P: J25.55 ; port ADC_CLK_225.CLK_P
ADC_CLK_226_N: J25.71 ; port ADC_CLK_226.CLK_N
ADC_CLK_226_P: J25.73 ; port ADC_CLK_226.CLK_P
ADC_CLK_227_N: J25.89 ; port ADC_CLK_227.CLK_N
ADC_CLK_227_P: J25.91 ; port ADC_CLK_227.CLK_P
CK_FPGAIO_N: J25.23 ; port CK_FPGAIO.CLK_N
CK_FPGAIO_P: J25.25 ; port CK_FPGAIO.CLK_P
CLK1_N: J25.16 ; port Helper_DCXO_CLK.CLK_N
CLK1_P: J25.18 ; port Helper_DCXO_CLK.CLK_P
CLK2_N: J25.20 ; port FPGA_CLK.CLK_N
CLK2_P: J25.22 ; port FPGA_CLK.CLK_P
CLK3_N: J25.21 ; port CLKREC.CLK_N
CLK3_P: J25.19 ; port CLKREC.CLK_P
CLKA_N: J25.38
CLKA_P: J25.36
CLKB_N: J25.56
CLKB_P: J25.54
CLKC_N: J25.74
CLKC_P: J25.72
CLKD_N: B8.1 J25.92
CLKD_P: B7.1 J25.90
CLKE_N: B11.1 J25.104
CLKE_P: B10.1 J25.102
CLKF_N: B13.1 J25.116
CLKF_P: B12.1 J25.114
DAC0_N: J25.155 ; port DAC0_N
DAC0_P: J25.157 ; port DAC0_P
DAC1_N: J25.149 ; port DAC1_N  [project net DAC0_N]
DAC1_P: J25.151 ; port DAC1_P  [project net DAC0_P]
DAC2_N: J25.137 ; port DAC2_N  [project net DAC0_N]
DAC2_P: J25.139 ; port DAC2_P  [project net DAC0_P]
DAC3_N: J25.131 ; port DAC3_N  [project net DAC0_N]
DAC3_P: J25.133 ; port DAC3_P  [project net DAC0_P]
DAC4_N: J25.125 ; port DAC4_N  [project net DAC0_N]
DAC4_P: J25.127 ; port DAC4_P  [project net DAC0_P]
DAC5_N: J25.119 ; port DAC5_N  [project net DAC0_N]
DAC5_P: J25.121 ; port DAC5_P  [project net DAC0_P]
DAC6_N: J25.107 ; port DAC6_N  [project net DAC0_N]
DAC6_P: J25.109 ; port DAC6_P  [project net DAC0_P]
DAC7_N: J25.101 ; port DAC7_N  [project net DAC0_N]
DAC7_P: J25.103 ; port DAC7_P  [project net DAC0_P]
DAC_CLK_228_N: J25.113 ; port DAC_CLK_228.CLK_N
DAC_CLK_228_P: J25.115 ; port DAC_CLK_228.CLK_P
DAC_CLK_229_N: J25.143 ; port DAC_CLK_229.CLK_N
DAC_CLK_229_P: J25.145 ; port DAC_CLK_229.CLK_P
DAC_SYSREFCLK_N: J25.110 ; port DAC_SYSREFCLK.CLK_N
DAC_SYSREFCLK_P: J25.108 ; port DAC_SYSREFCLK.CLK_P
EEM_IO.LVDS_N0: J25.13
EEM_IO.LVDS_N1: J25.17
EEM_IO.LVDS_N2: J25.9
EEM_IO.LVDS_N3: J25.5
EEM_IO.LVDS_N4: J25.26
EEM_IO.LVDS_N5: J25.12
EEM_IO.LVDS_N6: J25.8
EEM_IO.LVDS_N7: J25.4
EEM_IO.LVDS_P0: J25.11
EEM_IO.LVDS_P1: J25.15
EEM_IO.LVDS_P2: J25.7
EEM_IO.LVDS_P3: J25.3
EEM_IO.LVDS_P4: J25.24
EEM_IO.LVDS_P5: J25.14
EEM_IO.LVDS_P6: J25.10
EEM_IO.LVDS_P7: J25.6
EXT_CLK_IN1_N: J25.158 ; port EXT_CLK_IN1.CLK_N
EXT_CLK_IN1_P: J25.156 ; port EXT_CLK_IN1.CLK_P
FPGA_UART_RX: J25.140 ; port FPGA_UART_RX
Helper_DCXO_SCL: J25.148 ; port Helper_DCXO.SCL
Helper_DCXO_SDA: J25.146 ; port Helper_DCXO.SDA
Main_DCXO_SCL: J25.144 ; port Main_DCXO.SCL
Main_DCXO_SDA: J25.142 ; port Main_DCXO.SDA
RFPLL_LE0: IC21.4(1Y0) ; port RFPLL_CTRL0.LE  [project net LE]
RFPLL_LE1: IC21.5(1Y1) ; port RFPLL_CTRL1.LE  [project net LE]
RFPLL_LE2: IC21.6(1Y2) ; port RFPLL_CTRL2.LE  [project net LE]
RFPLL_LE_SEL0: IC21.2(1A0) J25.136
RFPLL_LE_SEL1: IC21.3(1A1) J25.138
RFPLL_SCKI: J25.132 ; port RFPLL_CTRL0.SCKI, port RFPLL_CTRL1.SCKI, port RFPLL_CTRL2.SCKI
RFPLL_SDI: J25.134 ; port RFPLL_CTRL0.SDI, port RFPLL_CTRL1.SDI, port RFPLL_CTRL2.SDI
SPI_CLK: J25.124 ; port SPI_CLK
SPI_CSn: J25.126 ; port SPI_CSn
SPI_LDn: J25.130 ; port SPI_LDn
SPI_MISO: J25.128 ; port SPI_MISO
SPI_MOSI: J25.122 ; port SPI_MOSI

Not connected (* = marked no-connect by the designer): IC21 7(1Y3)* 9(2Y3)* 10(2Y2)* 11(2Y1)* 12(2Y0)*; J25 1* 2* 150* 152*

### Buses and harness runs
bus EEM_IO.LVDS_N[0..7]
bus EEM_IO.LVDS_P[0..7]
harness EEM_IO = port EEM_IO

### Layout directives
differential pair; differential pair class 100 Ohms Trace diff; net class D100: ADC0_N, ADC0_P, ADC1_N, ADC1_P, ADC2_N, ADC2_P, ADC3_N, ADC3_P, ADC4_N, ADC4_P, ADC5_N, ADC5_P, ADC6_N, ADC6_P, ADC7_N, ADC7_P, ADC_CLK_224_N, ADC_CLK_224_P, ADC_CLK_225_N, ADC_CLK_225_P, ADC_CLK_226_N, ADC_CLK_226_P, ADC_CLK_227_N, ADC_CLK_227_P, DAC0_N, DAC0_P, DAC1_N, DAC1_P, DAC2_N, DAC2_P, DAC3_N, DAC3_P, DAC4_N, DAC4_P, DAC5_N, DAC5_P, DAC6_N, DAC6_P, DAC7_N, DAC7_P, DAC_CLK_228_N, DAC_CLK_228_P, DAC_CLK_229_N, DAC_CLK_229_P
differential pair: CK_FPGAIO_N, CK_FPGAIO_P, CLK1_N, CLK1_P, CLK2_N, CLK2_P, CLK3_N, CLK3_P, CLKD_N, CLKD_P, CLKE_N, CLKE_P, CLKF_N, CLKF_P, DAC_SYSREFCLK_N, DAC_SYSREFCLK_P, EEM_IO.LVDS_N0, EEM_IO.LVDS_N1, EEM_IO.LVDS_N2, EEM_IO.LVDS_N3, EEM_IO.LVDS_N4, EEM_IO.LVDS_N5, EEM_IO.LVDS_N6, EEM_IO.LVDS_N7, EEM_IO.LVDS_P0, EEM_IO.LVDS_P1, EEM_IO.LVDS_P2, EEM_IO.LVDS_P3, EEM_IO.LVDS_P4, EEM_IO.LVDS_P5, EEM_IO.LVDS_P6, EEM_IO.LVDS_P7
differential pair; differential pair class Diff_100Ohm: (no net found under the mark)

### Notes on the sheet
- B65_L3_P
- B65_L3_N
- B65_L9_P
- B65_L9_N
- B65_L2_N
- B65_L2_P
- B65_L5_N
- B65_L5_P
- B65_L6_P
- B65_L6_N
- B65_L1_P
- B65_L1_N
- B65_L8_P
- (near J25) GC
- B65_L4_N
- B65_L4_P
- B65_L12_N
- B65_L12_P
- B65_L11_N
- B65_L8_N
- B65_L13_N
- B65_L13_P
- GC
- B65_L11_P
- B65_L16_P
- B65_L16_N
- (near J25) DAC0
- (near J25) DAC1
- (near J25) DAC2
- (near J25) DAC3
- B88_L5_P
- B88_L5_N
- B88_L6_P
- B88_L6_N
- B88_L7_P
- (near J25) DAC4
- (near J25) DAC5
- B88_L7_N
- B88_L8_P
- B88_L8_N
- B88_L9_P
- B88_L9_N
- B88_L10_P
- B88_L10_N
- B88_L11_P
- B88_L11_N
- (near J25) DAC6
- (near J25) DAC7
- Project/Equipment
- Document
- Designer
- Drawn by
- Check.by
- Copyright WUT ISE 2020.
  This documentation describes Open Hardware and is licensed under the CERN OHL v.1.2. You may redistribute and modify this documentation under the terms of the CERN OHL v.1.2. (http://ohwr.org/CERNOHL). This documentation is distributed WITHOUT ANY EXPRESS OR IMPLIED WARRANTY, INCLUDING OF MERCHANTABILITY, SATISFACTORY QUALITY AND FITNESS FOR A PARTICULAR PURPOSE. Please see the CERN OHL v.1.2 for applicable conditions.
- Contact
- File
- Last Mod.
- Print Date
- Sheet
- Size
- A3
- of
- Rev

### Library data of the parts
B1-B13 B15 = SMD_PAD_D1MM: Through Hole Pad; Part Description: 1mm Diameter SMD Pad; Mounted: No; Part Number: SMD_PAD_D1MM; Component Type: Standard (No BOM); Pin Count: 1; Family: SMD Pad; Socket: No; SMD: No; Sense: No; Status: None; ComponentHeight: 0mm; HelpURL: Undefined; Author: CERN DEM JLC; CreateDate: 10.10.2017; LatestRevisionDate: 10.10.2017; PackageDescription: 1mm Diameter SMD Pad
C159 = CC0402_100NF_16V_10%_X7R: Non-polarised capacitor; Part Description: SMD Multilayer Chip Ceramic Capacitor; Manufacturer: GENERIC; Manufacturer1 Part Number: GRM155R71C104KA88D; Voltage: 16V; TC: X7R; Tolerance: ±10%; Part Number: CC0402_100NF_16V_10%_X7R; Component Kind: Standard; Component Type: Standard; Pin Count: 2; Value: 100nF; Status: Not Recommended; Manufacturer Part Number: CC0402_100NF_16V_10%_X7R; Case: 0402; Mounted: Yes; Socket: No; SMD: Yes; Sense: No; Manufacturer1 Example: MURATA; Manufacturer1 ComponentHeight: 0.55mm; HelpURL: \\cern.ch\dfs\Applications\Altium\Datasheets\CC0402_X7R_MURATA_GRM.pdf; Author: CERN DEM JLC; CreateDate: 05/12/2013; LatestRevisionDate: 03/12/2007
IC21 = SN74LV139AD: Dual 2-to-4 line decoder/demultiplexer; Manufacturer: TEXAS INSTRUMENTS; PressFit: No; Bonding: No; Part Number: SN74LV139AD; Component Kind: Standard; Component Type: Standard; Device: SN74LV139AD; PackageDescription: SOIC 16, Pitch 1.27mm - Body 4x10mm, IPC Medium Density; Part Description: Dual 2-to-4 Line Decoder/Demultiplexer; Manufacturer Part Number: SN74LV139AD; Pin Count: 16; Case: SOIC16; Mounted: Yes; Socket: No; SMD: Yes; Sense: No; ComponentHeight: 1.75mm; Author: CERN DEM JLC; HelpURL: \\cern.ch\dfs\Applications\Altium\Datasheets\SN74LV139AD.pdf; CreateDate: 25.01.2012; LatestRevisionDate: 25.01.2012
J25 = SAMTEC_SS5-80-3.00-L-D-K: as J24 on sheet B2B_1; Part Number: SAMTEC_SS5-80-3.00-L-D-K; Component Kind: Standard; Component Type: Standard; Pin Count: 160; Family: Socket 160; Mounted: Yes; Socket: No; SMD: Yes; Sense: No; Status: None; Manufacturer Part Number: SS5-80-3.00-L-D-K; ComponentHeight: 4mm; HelpURL: \\cern.ch\dfs\Applications\Altium\Datasheets\SAMTEC_SS5-80-3.00-L-D-K.pdf; Author: CERN DEM BC; CreateDate: 11.08.2021; LatestRevisionDate: 11.08.2021

## Sheet PWR_3V3.SchDoc: RFSOC SAWG
size 420 x 297 mm; Author: G.Kasprowicz; CompanyName: WUT ISE; DrawnBy: G.Kasprowicz; Organization: WUT ISE; Address1: PW ISE; Address2: Nowowiejska 15/19 00-665 Warsaw; Address3: gkasprow@gmail.com; DocumentNumber: 16; Revision: 1; SheetNumber: 16; SheetTotal: 20; ModifiedBy: -; CheckedDate: -; Title2: PWR 3V3; DivGrp: WUT ISE; Designer: G.Kasprowicz; ModifiedDate: -; ProjectName: Sensor Box
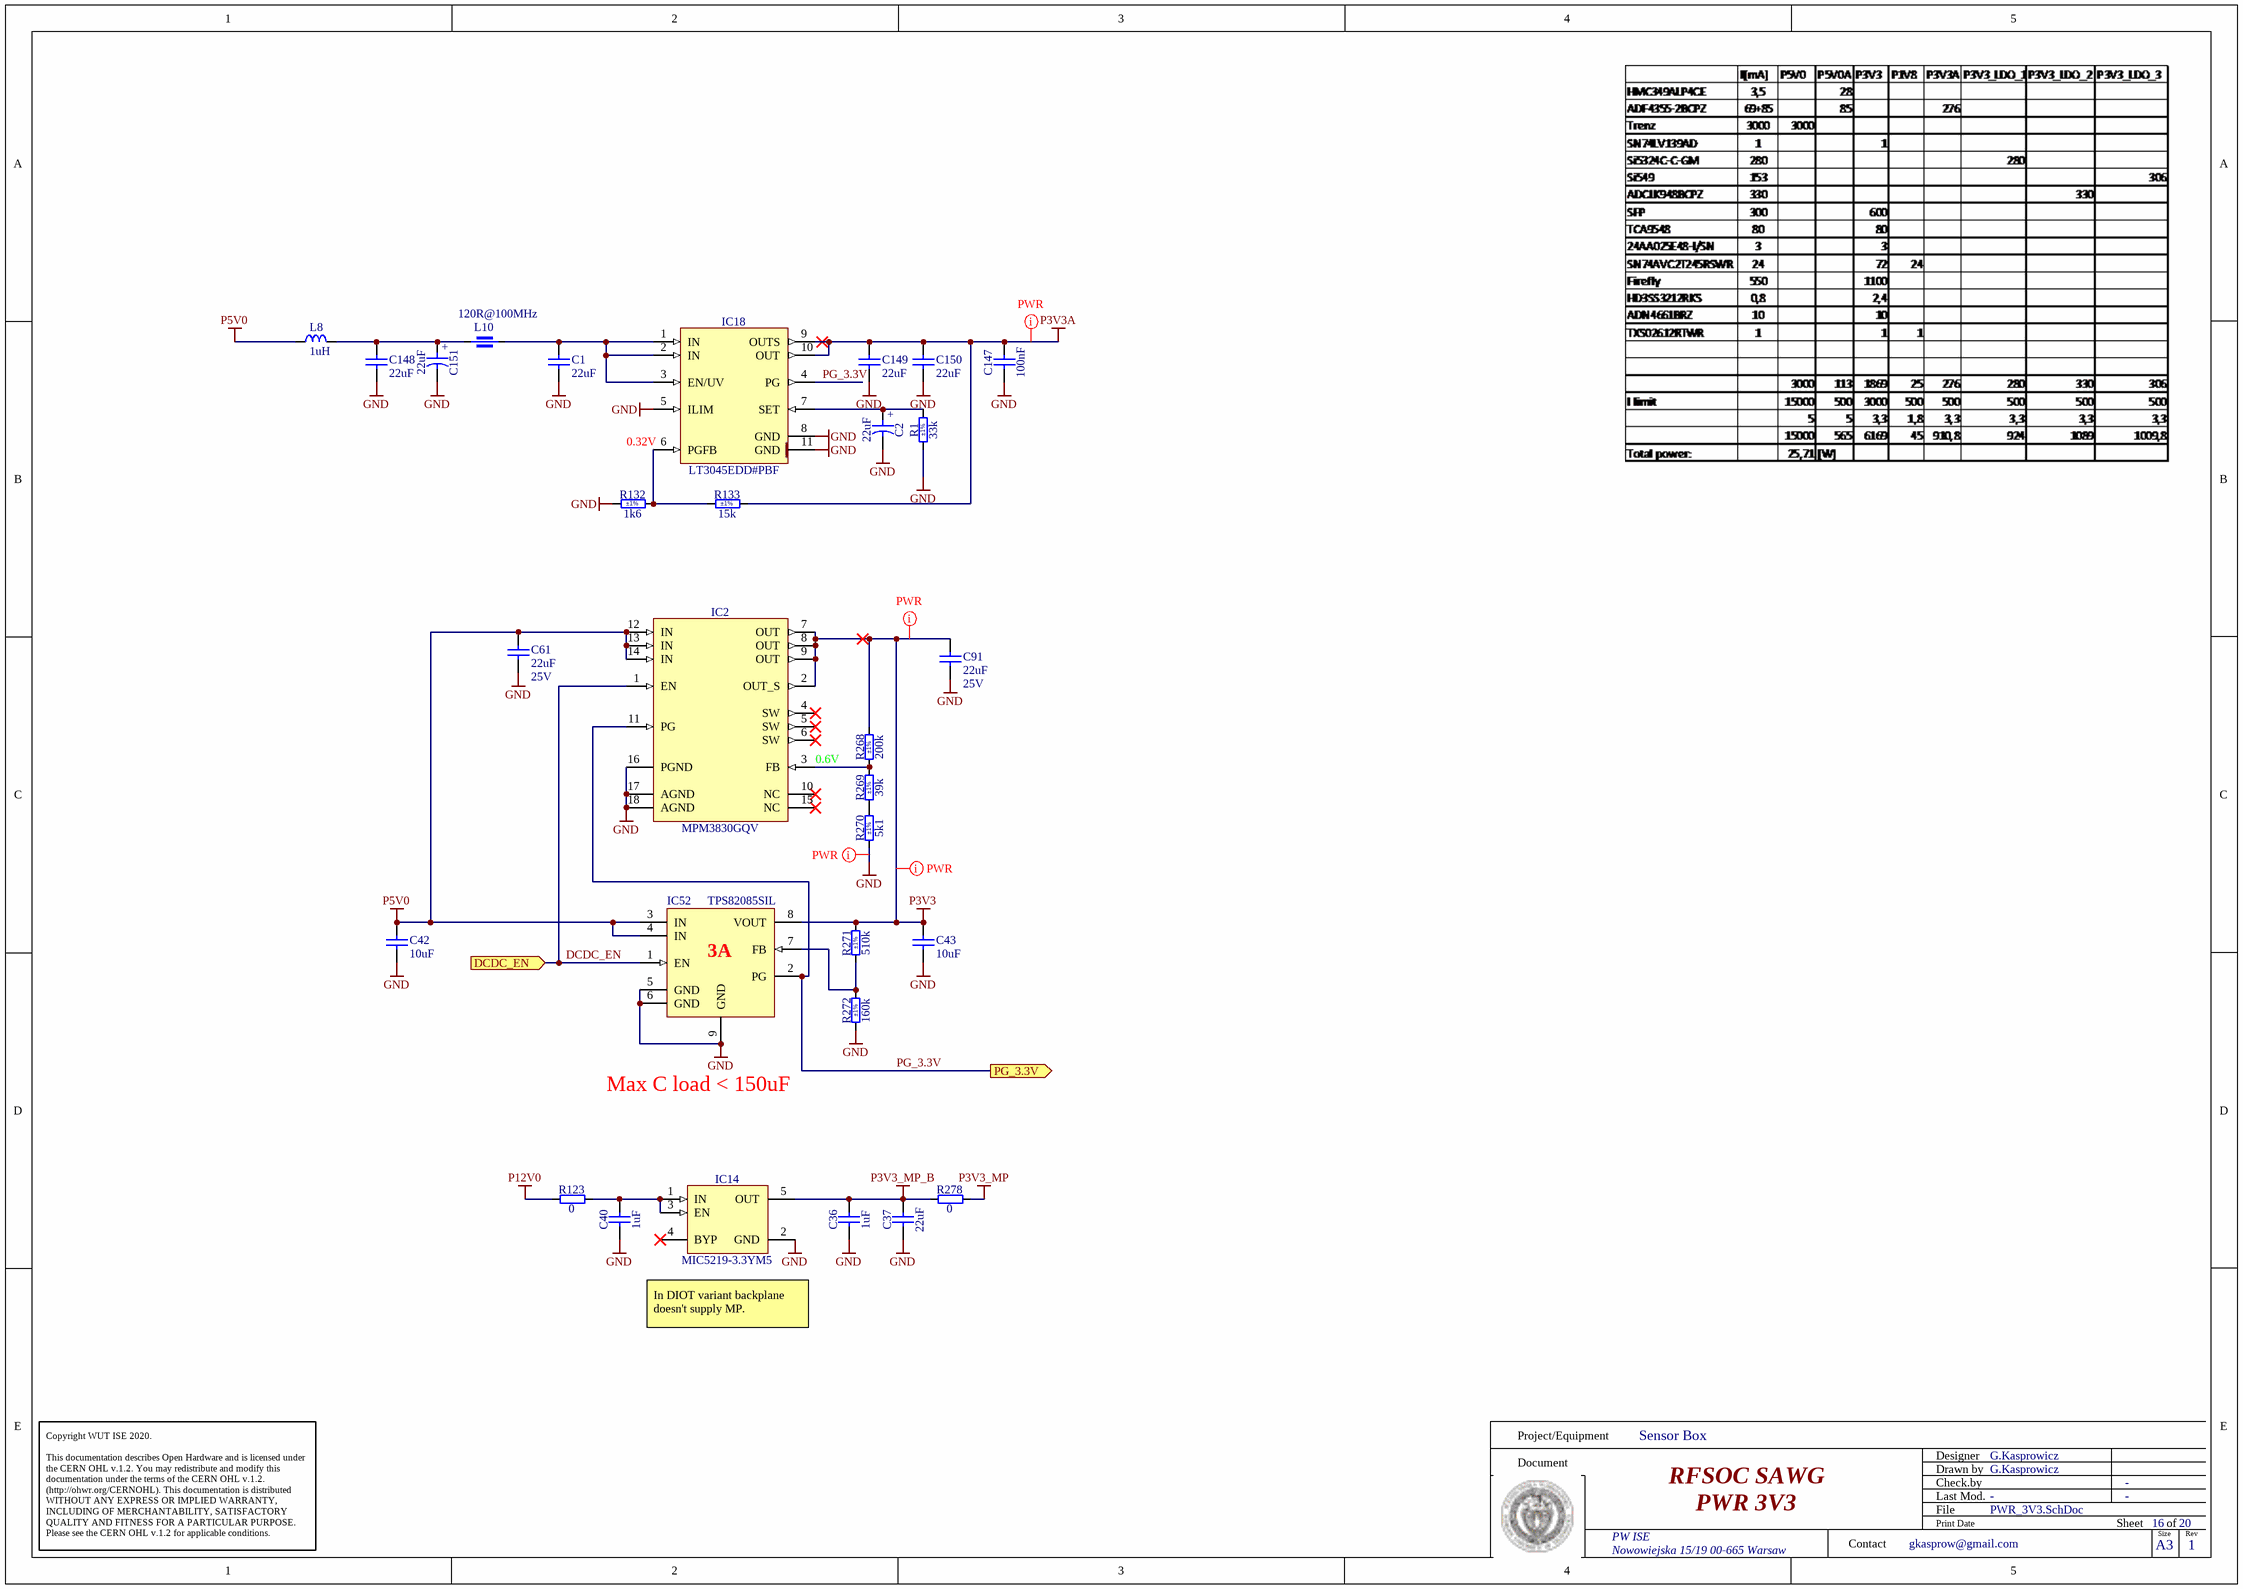
[diagram p7: PWR_3V3.SchDoc]

### Parts
C1  22uF  [CAPC2012X135N]
C2  22uF  [CAPMP3528X210N]
C36  1uF  [CAPC1608X87N]
C37  22uF  [CAPC1608X90N]
C40  1uF  [CAPC1608X87N]
C42  10uF  [CAPC1608X80N]
C43  10uF  [CAPC1608X80N]
C61  22uF  Voltage: 25V  [CAPC2012X145N]
C91  22uF  Voltage: 25V  [CAPC2012X145N]
C147  100nF  [CAPC1005X55N]
C148  22uF  [CAPC2012X135N]
C149  22uF  [CAPC2012X135N]
C150  22uF  [CAPC2012X135N]
C151  22uF  [CAPMP3528X210N]
IC2  MPM3830GQV  [MPS_MPM38XXGQV]
IC14  MIC5219-3.3YM5  [SOT95P280X145-5N]
IC18  LT3045EDD#PBF  [SON50P300X300X80-11N-R175X248]
IC52  TPS82085SIL  [TPS82085SILR]
L8  1uH  [INDC2520X120N]
L10  120R@100MHz  [INDC1608X65N]
R1  33k  Tolerance: ±1%  [RESC1005X40N]
R123  0  [RESC1005X40N]
R132  1k6  Tolerance: ±1%  [RESC1005X40N]
R133  15k  Tolerance: ±1%  [RESC1005X40N]
R268  200k  Tolerance: ±1%  [RESC1005X40N]
R269  39k  Tolerance: ±1%  [RESC1005X40N]
R270  5k1  Tolerance: ±1%  [RESC1005X40N]
R271  510k  Tolerance: ±1%  [RESC1005X40N]
R272  160k  Tolerance: ±1%  [RESC1005X40N]
R278  0  [RESC1005X40N]

### Ports
DCDC_EN (in), PG_3.3V (out)

### Nets
GND: C1.2 C2.2 C36.1 C37.1 C40.1 C42.2 C43.2 C61.1 C91.1 C147.1 C148.2 C149.2 C150.2 C151.2 IC2.16(PGND) IC2.17(AGND) IC2.18(AGND) IC14.2(GND) IC18.5(ILIM) IC18.8(GND) IC18.11(GND) IC52.5(GND) IC52.6(GND) IC52.9(GND) R1.1 R132.1 R270.1 R272.1
P3V3: C43.1 C91.2 IC2.2(OUT_S) IC2.7(OUT) IC2.8(OUT) IC2.9(OUT) IC52.8(VOUT) R268.2 R271.2
P3V3_MP: R278.2
P3V3_MP_B: C36.2 C37.2 IC14.5(OUT) R278.1
P3V3A: C147.2 C149.1 C150.1 IC18.9(OUTS) IC18.10(OUT) R133.2
P5V0: C42.1 C61.2 IC2.12(IN) IC2.13(IN) IC2.14(IN) IC52.3(IN) IC52.4(IN) L8.1
P12V0: R123.1
DCDC_EN: IC2.1(EN) IC52.1(EN) ; port DCDC_EN
PG_3.3V: IC2.11(PG) IC18.4(PG) IC52.2(PG) ; port PG_3.3V  [project net PG_1.8V]
NetC1_1: C1.1 IC18.1(IN) IC18.2(IN) IC18.3(EN/UV) L10.2
NetC2_1: C2.1 IC18.7(SET) R1.2
NetC40_2: C40.2 IC14.1(IN) IC14.3(EN) R123.2
NetC148_1: C148.1 C151.1 L8.2 L10.1
NetIC2_3: IC2.3(FB) R268.1 R269.2
NetIC18_6: IC18.6(PGFB) R132.2 R133.1
NetIC52_7: IC52.7(FB) R271.1 R272.2
NetR269_1: R269.1 R270.2

Not connected (* = marked no-connect by the designer): IC2 4(SW)* 5(SW)* 6(SW)* 10(NC)* 15(NC)*; IC14 4(BYP)*

### Layout directives
net class PWR: GND, P3V3, P3V3A

### Notes on the sheet
- (near IC18) 0.32V
- 0.6V
- (near IC52) 3A
- Max C load < 150uF
- In DIOT variant backplane doesn't supply MP.
- Project/Equipment
- Document
- Designer
- Drawn by
- Check.by
- Copyright WUT ISE 2020.
  This documentation describes Open Hardware and is licensed under the CERN OHL v.1.2. You may redistribute and modify this documentation under the terms of the CERN OHL v.1.2. (http://ohwr.org/CERNOHL). This documentation is distributed WITHOUT ANY EXPRESS OR IMPLIED WARRANTY, INCLUDING OF MERCHANTABILITY, SATISFACTORY QUALITY AND FITNESS FOR A PARTICULAR PURPOSE. Please see the CERN OHL v.1.2 for applicable conditions.
- Contact
- File
- Last Mod.
- Print Date
- Sheet
- Size
- A3
- of
- Rev
- (in symbol CTE3528-21_22UF_10V_10%_LESR0700) +

### Library data of the parts
C1 C148-C150 = CC0805_22UF_16V_10%_X5R: Non-polarised capacitor; Part Description: SMD Multilayer Chip Ceramic Capacitor; Manufacturer: GENERIC; Manufacturer1 Part Number: C2012X5R1C226KT; Voltage: 16V; TC: X5R; Tolerance: ±10%; Part Number: CC0805_22UF_16V_10%_X5R; Component Kind: Standard; Component Type: Standard; Pin Count: 2; Value: 22uF; Status: Preferred; Manufacturer Part Number: CC0805_22UF_16V_10%_X5R; Case: 0805; Mounted: Yes; Socket: No; SMD: Yes; Sense: No; Manufacturer1 Example: TDK; Manufacturer1 ComponentHeight: 1.35mm; HelpURL: \\cern.ch\dfs\Applications\Altium\Datasheets\CC0805_X5R_TDK_C.pdf; Author: CERN DEM JLC; CreateDate: 25.10.2012; LatestRevisionDate: 25.10.2012
C2 C151 = CTE3528-21_22UF_10V_10%_LESR0700: Polarised capacitor; Part Description: Low ESR 0R7 Solid Tantalum Chip Capacitor; Manufacturer: GENERIC; Manufacturer1 Part Number: TPSB226K010R0700; Voltage: 10V; Tolerance: ±10%; Part Number: CTE3528-21_22UF_10V_10%_LESR0700; Component Kind: Standard; Component Type: Standard; Pin Count: 2; Value: 22uF; Status: Preferred; Manufacturer Part Number: CTE3528-21_22UF_10V_10%_LESR0700; Case: B; Mounted: Yes; Socket: No; SMD: Yes; Sense: No; Manufacturer1 Example: AVX; Manufacturer1 ComponentHeight: 2.1mm; HelpURL: \\cern.ch\dfs\Applications\Altium\Datasheets\CTE-LESR_AVX_TPS.pdf; Author: CERN DEM JLC; CreateDate: 05.05.2008; LatestRevisionDate: 20.01.2009
C36 C40 = CC0603_1UF_25V_10%_X7R: Non-polarised capacitor; Part Description: SMD Multilayer Chip Ceramic Capacitor; Manufacturer: GENERIC; Manufacturer1 Part Number: GRM188R71E105KA12D; Voltage: 25V; TC: X7R; Tolerance: ±10%; Part Number: CC0603_1UF_25V_10%_X7R; Component Kind: Standard; Component Type: Standard; Pin Count: 2; Value: 1uF; Status: None; Manufacturer Part Number: CC0603_1UF_25V_10%_X7R; Case: 0603; Mounted: Yes; Socket: No; SMD: Yes; Sense: No; Manufacturer1 Example: MURATA; Manufacturer1 ComponentHeight: 0.9mm; HelpURL: \\cern.ch\dfs\Applications\Altium\Datasheets\CC0603_X7R_MURATA.pdf; Author: CERN DEM JLC; CreateDate: 18.01.2011; LatestRevisionDate: 18.01.2011
C37 = CC0603_22UF_6.3V_20%_X5R: Non-polarised capacitor; Part Description: SMD Multilayer Chip Ceramic Capacitor; Manufacturer: GENERIC; Manufacturer1 Part Number: C1608X5R0J226M080; Voltage: 6.3V; TC: X5R; Tolerance: ±20%; Part Number: CC0603_22UF_6.3V_20%_X5R; Component Kind: Standard; Component Type: Standard; Pin Count: 2; Value: 22uF; Status: None; Manufacturer Part Number: CC0603_22UF_6.3V_20%_X5R; Case: 0603; Mounted: Yes; Socket: No; SMD: Yes; Sense: No; Manufacturer1 Example: TDK; Manufacturer1 ComponentHeight: 0.9mm; HelpURL: \\cern.ch\dfs\Applications\Altium\Datasheets\CC0603_X5R_TDK_C.pdf; Author: CERN DEM JLC; CreateDate: 16.12.2013; LatestRevisionDate: 03.12.2020
C42 C43 = CC0603_10UF_16V_20%_X5R: Non-polarised capacitor; Part Description: SMD Multilayer Chip Ceramic Capacitor; Manufacturer: GENERIC; Manufacturer1 Part Number: GRM188R61C106MA73D; Voltage: 16V; Tolerance: ±20%; TC: X5R; Case: 0603; Value: 10uF; Part Number: CC0603_10UF_16V_20%_X5R; Component Kind: Standard; Component Type: Standard; Pin Count: 2; Status: None; Manufacturer Part Number: CC0603_10UF_16V_20%_X5R; Mounted: Yes; Socket: No; SMD: Yes; Sense: No; Manufacturer1 Example: MURATA; Manufacturer1 ComponentHeight: 0.8mm; HelpURL: \\cern.ch\dfs\Applications\Altium\Datasheets\CC0603_X5R_MURATA_GRM.pdf; Author: CERN DEM MR; CreateDate: 02.03.2016; LatestRevisionDate: 02.03.2016
C61 C91 = CC0805_22UF_25V_20%_X5R: Non-polarised capacitor; Part Description: Chip Multilayer Ceramic Capacitor for General Purpose; Manufacturer: GENERIC; Manufacturer1 Part Number: GRM21BR61E226ME44; Tolerance: ±20%; TC: X5R; Case: 0805; Value: 22uF; Part Number: CC0805_22UF_25V_20%_X5R; Component Kind: Standard; Component Type: Standard; Pin Count: 2; Status: Preferred; Manufacturer Part Number: CC0805_22UF_25V_20%_X5R; Mounted: Yes; Socket: No; SMD: Yes; Sense: No; ComponentHeight: 1.45mm; Manufacturer1 Example: MURATA; Manufacturer1 ComponentHeight: 1.45mm; HelpURL: \\cern.ch\dfs\Applications\Altium\Datasheets\CC0805_MURATA_GRM21BR61E226ME44.pdf; Author: CERN DEM WB; CreateDate: 08.10.2021; LatestRevisionDate: 08.10.2021
C147 = CC0402_100NF_16V_10%_X5R: Non-polarised capacitor; Part Description: SMD Multilayer Chip Ceramic Capacitor; Manufacturer: GENERIC; Manufacturer1 Part Number: GRM155R61C104KA88D; Voltage: 16V; TC: X5R; Tolerance: ±10%; Part Number: CC0402_100NF_16V_10%_X5R; Component Kind: Standard; Component Type: Standard; Pin Count: 2; Value: 100nF; Status: None; Manufacturer Part Number: CC0402_100NF_16V_10%_X5R; Case: 0402; Mounted: Yes; Socket: No; SMD: Yes; Sense: No; Manufacturer1 Example: MURATA; Manufacturer1 ComponentHeight: 0.55mm; HelpURL: \\cern.ch\dfs\Applications\Altium\Datasheets\CC0402_X5R_MURATA_GRM.pdf; Author: CERN DEM JLC; CreateDate: 10.12.2013; LatestRevisionDate: 10.12.2013
IC2 = MPM3830GQV: 2.8V to 5.5V Input, 4A, Power Module Synchronous Step-Down Converter with Integrated Inductor; Part Description: 6V Input, 3A, Module Synchronous Step-Down Converter with Integrated Inductor; Manufacturer: MPS (MONOLITIC  POWER SYSTEMS); PressFit: No; Bonding: No; Part Number: MPM3830GQV; Component Kind: Standard; Component Type: Standard; Device: MPM3830GQV; PackageDescription: MPS QFN-20 Case, 0.50mm Pitch, Rect.; 18 Pin, 3.00mm L X 5.00mm W X 1.65mm H body, (w/Thermal Tab x2); Manufacturer Part Number: MPM3830GQV; Pin Count: 20; Case: QFN20; Mounted: Yes; Socket: No; SMD: Yes; Sense: No; ComponentHeight: 1.65mm; HelpURL: \\cern.ch\dfs\Applications\Altium\Datasheets\MPM3830GQV.pdf; Author: CERN DEM BC; CreateDate: 23.11.2020; LatestRevisionDate: 23.11.2020
IC14 = MIC5219-3.3YM5: 500mA Peak Output LDO Regulator; Part Description: 3.3V 500mA Peak Output Low Drop-Out  (LDO) Regulator; Manufacturer: MICROCHIP TECHNOLOGY; PressFit: No; Bonding: No; Part Number: MIC5219-3.3YM5; Component Kind: Standard; Component Type: Standard; Device: MIC5219-3.3YM5; PackageDescription: SOT, 0.95mm pitch; 5 pin, 1.60mm W X 2.90mm L X 1.45mm H body, IPC Medium Density; Manufacturer Part Number: MIC5219-3.3YM5; Pin Count: 5; Case: SOT23-5; Mounted: Yes; Socket: No; SMD: Yes; Sense: No; ComponentHeight: 1.45mm; HelpURL: \\cern.ch\dfs\Applications\Altium\Datasheets\MIC5219-3.3YM5.pdf; Author: CERN DEM WB; CreateDate: 2019-04-16; LatestRevisionDate: 2019-04-16
IC18 = LT3045EDD#PBF: 20V, 500mA, Ultralow Noise, Ultrahigh PSRR Linear Regulator; Manufacturer: LINEAR TECHNOLOGY; PressFit: No; Bonding: No; Part Number: LT3045EDD#PBF; Component Kind: Standard; Component Type: Standard; Device: LT3045EDD#PBF; PackageDescription: SON, 0.50mm Pitch, 10-pin, 3.00mm W  X 3.00mm L X 0.80mm Height, (w/thermal tab 1.75 X 2.48 mm), IPC Medium Density; Part Description: 20V, 500mA, Ultralow Noise, Ultrahigh PSRR Linear Regulator; Manufacturer Part Number: LT3045EDD#PBF; Pin Count: 11; Case: SON10; Mounted: Yes; Socket: No; SMD: Yes; Sense: No; ComponentHeight: 0.8mm; HelpURL: \\cern.ch\dfs\Applications\Altium\Datasheets\LT3045EDD#PBF.pdf; Author: CERN DEM JLC; CreateDate: 07.12.2016; LatestRevisionDate: 07.12.2016
IC52 = 27101: AN: 27101; Mixed: SMT; Trenz-Stock: Yes; Temperature-Range: -40/+125 (Tj); Extra: 3A, 2.5-6VIN High-Efficiency Step-Down Converter with Integrated Inductor; Case: µsil8; HelpURL: B:\AD\adlib\datasheet\TPS82085; H-ART: TPS82085SIL; Storage-Temperature: -55/+125 (Abs)
L8 = IND1008_1UH_20%_TDK_TFM252012ALVA1R0M: Inductor; Part Description: Inductors for Power Circuits Thin-Film Metal Magnetic Material (TFM-ALVA Series for Automotive); Manufacturer: TDK; Tolerance: ±20%; Power: 4.7A; Resistance: 0.035R; Case: 1008; Value: 1uH; HelpURL: \\cern.ch\dfs\Applications\Altium\Datasheets\IND_TDK_TFM252012ALVA.pdf; Part Number: IND1008_1UH_20%_TDK_TFM252012ALVA1R0M; Component Kind: Standard; Component Type: Standard; Pin Count: 2; Manufacturer Part Number: TFM252012ALVA1R0M; Mounted: Yes; Socket: No; SMD: Yes; Sense: No; ComponentHeight: 1.2mm; Author: CERN DEM BC; CreateDate: 16.04.2020; LatestRevisionDate: 16.04.2020
L10 = IND0603_MURATA_BLM18SG121TN1D: Part Description: SMD EMIFIL Suppression Chip Ferrite Bead; Manufacturer: MURATA; Power: 3A; Resistance: 0.025R; Tolerance: ±25%; Case: 0603; HelpURL: \\cern.ch\dfs\Applications\Altium\Datasheets\IND0603_MURATA_BLM18S.pdf; Part Number: IND0603_MURATA_BLM18SG121TN1D; Component Kind: Standard; Component Type: Standard; Pin Count: 2; Value: 120R@100MHz; Manufacturer Part Number: BLM18SG121TN1D; Mounted: Yes; Socket: No; SMD: Yes; Sense: No; ComponentHeight: 0.65mm; Author: CERN DEM JLC; CreateDate: 23.07.2014; LatestRevisionDate: 25.10.2018
R1 = R0402_33K_1%_0.0625W_100PPM: Resistor - 1%; Part Description: General Purpose Thick Film Chip Resistor; Manufacturer: GENERIC; Manufacturer1 Part Number: 232270673303L; TC: ±100ppm/°C; PressFit: No; Part Number: R0402_33K_1%_0.0625W_100PPM; Component Kind: Standard; Component Type: Standard; Pin Count: 2; Value: 33k; Status: Not Recommended; Power: 0.0625W; Manufacturer Part Number: R0402_33K_1%_0.0625W_100PPM; Case: 0402; Mounted: Yes; Sense: No; Socket: No; SMD: Yes; Manufacturer1 Example: YAGEO PHYCOMP; Manufacturer1 ComponentHeight: 0.4mm; HelpURL: \\cern.ch\dfs\Applications\Altium\Datasheets\R0402_Phycomp_RC0402.pdf; Author: CERN DEM JLC; CreateDate: 03.12.2007; LatestRevisionDate: 17.10.2012
R123 R278 = R0402_0R_JUMPER: Resistor; Part Description: 1A (0.05R Max DC Resistance) Zero Ohm Jumper; Manufacturer: GENERIC; Manufacturer1 Part Number: 232270591001L; Part Number: R0402_0R_JUMPER; Component Kind: Standard; Component Type: Standard; Pin Count: 2; Value: 0; Status: Not recommended; Manufacturer Part Number: R0402_0R_JUMPER; Case: 0402; Mounted: Yes; Sense: No; Socket: No; SMD: Yes; Manufacturer1 Example: YAGEO PHYCOMP; Manufacturer1 ComponentHeight: 0.4mm; HelpURL: \\cern.ch\dfs\Applications\Altium\Datasheets\R0402_Phycomp_RC0402.pdf; Author: CERN DEM JLC; CreateDate: 03.12.2007; LatestRevisionDate: 17.10.2012
R132 = R0402_1K6_1%_0.0625W_100PPM: Resistor - 1%; Part Description: General Purpose Thick Film Chip Resistor; Manufacturer: GENERIC; Manufacturer1 Part Number: 232270671602L; TC: ±100ppm/°C; PressFit: No; Part Number: R0402_1K6_1%_0.0625W_100PPM; Component Kind: Standard; Component Type: Standard; Pin Count: 2; Value: 1k6; Status: Not Recommended; Power: 0.0625W; Manufacturer Part Number: R0402_1K6_1%_0.0625W_100PPM; Case: 0402; Mounted: Yes; Sense: No; Socket: No; SMD: Yes; Manufacturer1 Example: YAGEO PHYCOMP; Manufacturer1 ComponentHeight: 0.4mm; HelpURL: \\cern.ch\dfs\Applications\Altium\Datasheets\R0402_Phycomp_RC0402.pdf; Author: CERN DEM JLC; CreateDate: 03.12.2007; LatestRevisionDate: 17.10.2012
R133 = R0402_15K_1%_0.0625W_100PPM: Resistor - 1%; Part Description: General Purpose Thick Film Chip Resistor; Manufacturer: GENERIC; Manufacturer1 Part Number: CRCW040215K0FK; TC: ±100ppm/°C; PressFit: No; Part Number: R0402_15K_1%_0.0625W_100PPM; Component Kind: Standard; Component Type: Standard; Pin Count: 2; Value: 15k; Status: None; Power: 0.0625W; Manufacturer Part Number: R0402_15K_1%_0.0625W_100PPM; Case: 0402; Mounted: Yes; Sense: No; Socket: No; SMD: Yes; Manufacturer1 Example: VISHAY; Manufacturer1 ComponentHeight: 0.4mm; HelpURL: \\cern.ch\dfs\Applications\Altium\Datasheets\R0402_VISHAY_CRCW e3.pdf; Author: CERN DEM JMW; CreateDate: 06.07.2015; LatestRevisionDate: 06.07.2015
R268 = R0402_200K_1%_0.0625W_100PPM: Resistor - 1%; Part Description: General Purpose Thick Film Chip Resistor; Manufacturer: GENERIC; Manufacturer1 Part Number: 232270672004L; TC: ±100ppm/°C; PressFit: No; Part Number: R0402_200K_1%_0.0625W_100PPM; Component Kind: Standard; Component Type: Standard; Pin Count: 2; Value: 200k; Status: Not Recommended; Power: 0.0625W; Manufacturer Part Number: R0402_200K_1%_0.0625W_100PPM; Case: 0402; Mounted: Yes; Sense: No; Socket: No; SMD: Yes; Manufacturer1 Example: YAGEO PHYCOMP; Manufacturer1 ComponentHeight: 0.4mm; HelpURL: \\cern.ch\dfs\Applications\Altium\Datasheets\R0402_Phycomp_RC0402.pdf; Author: CERN DEM JLC; CreateDate: 03.12.2007; LatestRevisionDate: 17.10.2012
R269 = R0402_39K_1%_0.0625W_100PPM: Resistor - 1%; Part Description: General Purpose Thick Film Chip Resistor; Manufacturer: GENERIC; Manufacturer1 Part Number: 232270673903; TC: ±100ppm/°C; PressFit: No; Part Number: R0402_39K_1%_0.0625W_100PPM; Component Kind: Standard; Component Type: Standard; Pin Count: 2; Value: 39k; Status: Not Recommended; Power: 0.0625W; Manufacturer Part Number: R0402_39K_1%_0.0625W_100PPM; Case: 0402; Mounted: Yes; Sense: No; Socket: No; SMD: Yes; Manufacturer1 Example: YAGEO PHYCOMP; Manufacturer1 ComponentHeight: 0.4mm; HelpURL: \\cern.ch\dfs\Applications\Altium\Datasheets\R0402_Phycomp_RC0402.pdf; Author: CERN DEM JLC; CreateDate: 03.12.2007; LatestRevisionDate: 17.10.2012
R270 = R0402_5K1_1%_0.0625W_100PPM: Resistor - 1%; Part Description: General Purpose Thick Film Chip Resistor; Manufacturer: GENERIC; Manufacturer1 Part Number: 232270675102L; TC: ±100ppm/°C; PressFit: No; Part Number: R0402_5K1_1%_0.0625W_100PPM; Component Kind: Standard; Component Type: Standard; Pin Count: 2; Value: 5k1; Status: Not Recommended; Power: 0.0625W; Manufacturer Part Number: R0402_5K1_1%_0.0625W_100PPM; Case: 0402; Mounted: Yes; Sense: No; Socket: No; SMD: Yes; Manufacturer1 Example: YAGEO PHYCOMP; Manufacturer1 ComponentHeight: 0.4mm; HelpURL: \\cern.ch\dfs\Applications\Altium\Datasheets\R0402_Phycomp_RC0402.pdf; Author: CERN DEM JLC; CreateDate: 03.12.2007; LatestRevisionDate: 17.10.2012
R271 = R0402_510K_1%_0.0625W_100PPM: Resistor - 1%; Part Description: General Purpose Thick Film Chip Resistor; Manufacturer: GENERIC; Manufacturer1 Part Number: 232270675104L; TC: ±100ppm/°C; PressFit: No; Part Number: R0402_510K_1%_0.0625W_100PPM; Component Kind: Standard; Component Type: Standard; Pin Count: 2; Value: 510k; Status: Not Recommended; Power: 0.0625W; Manufacturer Part Number: R0402_510K_1%_0.0625W_100PPM; Case: 0402; Mounted: Yes; Sense: No; Socket: No; SMD: Yes; Manufacturer1 Example: YAGEO PHYCOMP; Manufacturer1 ComponentHeight: 0.4mm; HelpURL: \\cern.ch\dfs\Applications\Altium\Datasheets\R0402_Phycomp_RC0402.pdf; Author: CERN DEM JLC; CreateDate: 03.12.2007; LatestRevisionDate: 17.10.2012
R272 = R0402_160K_1%_0.0625W_100PPM: Resistor - 1%; Part Description: General Purpose Thick Film Chip Resistor; Manufacturer: GENERIC; Manufacturer1 Part Number: 232270671604L; TC: ±100ppm/°C; PressFit: No; Part Number: R0402_160K_1%_0.0625W_100PPM; Component Kind: Standard; Component Type: Standard; Pin Count: 2; Value: 160k; Status: Not Recommended; Power: 0.0625W; Manufacturer Part Number: R0402_160K_1%_0.0625W_100PPM; Case: 0402; Mounted: Yes; Sense: No; Socket: No; SMD: Yes; Manufacturer1 Example: YAGEO PHYCOMP; Manufacturer1 ComponentHeight: 0.4mm; HelpURL: \\cern.ch\dfs\Applications\Altium\Datasheets\R0402_Phycomp_RC0402.pdf; Author: CERN DEM JLC; CreateDate: 03.12.2007; LatestRevisionDate: 17.10.2012